# Altium schematic sheet Sheet1.SchDoc
size A0; Organization: Altium Limited; Address1: L3, 12a Rodborough Rd; Address2: Frenchs Forest; Address3: NSW; Address4: Australia 2086
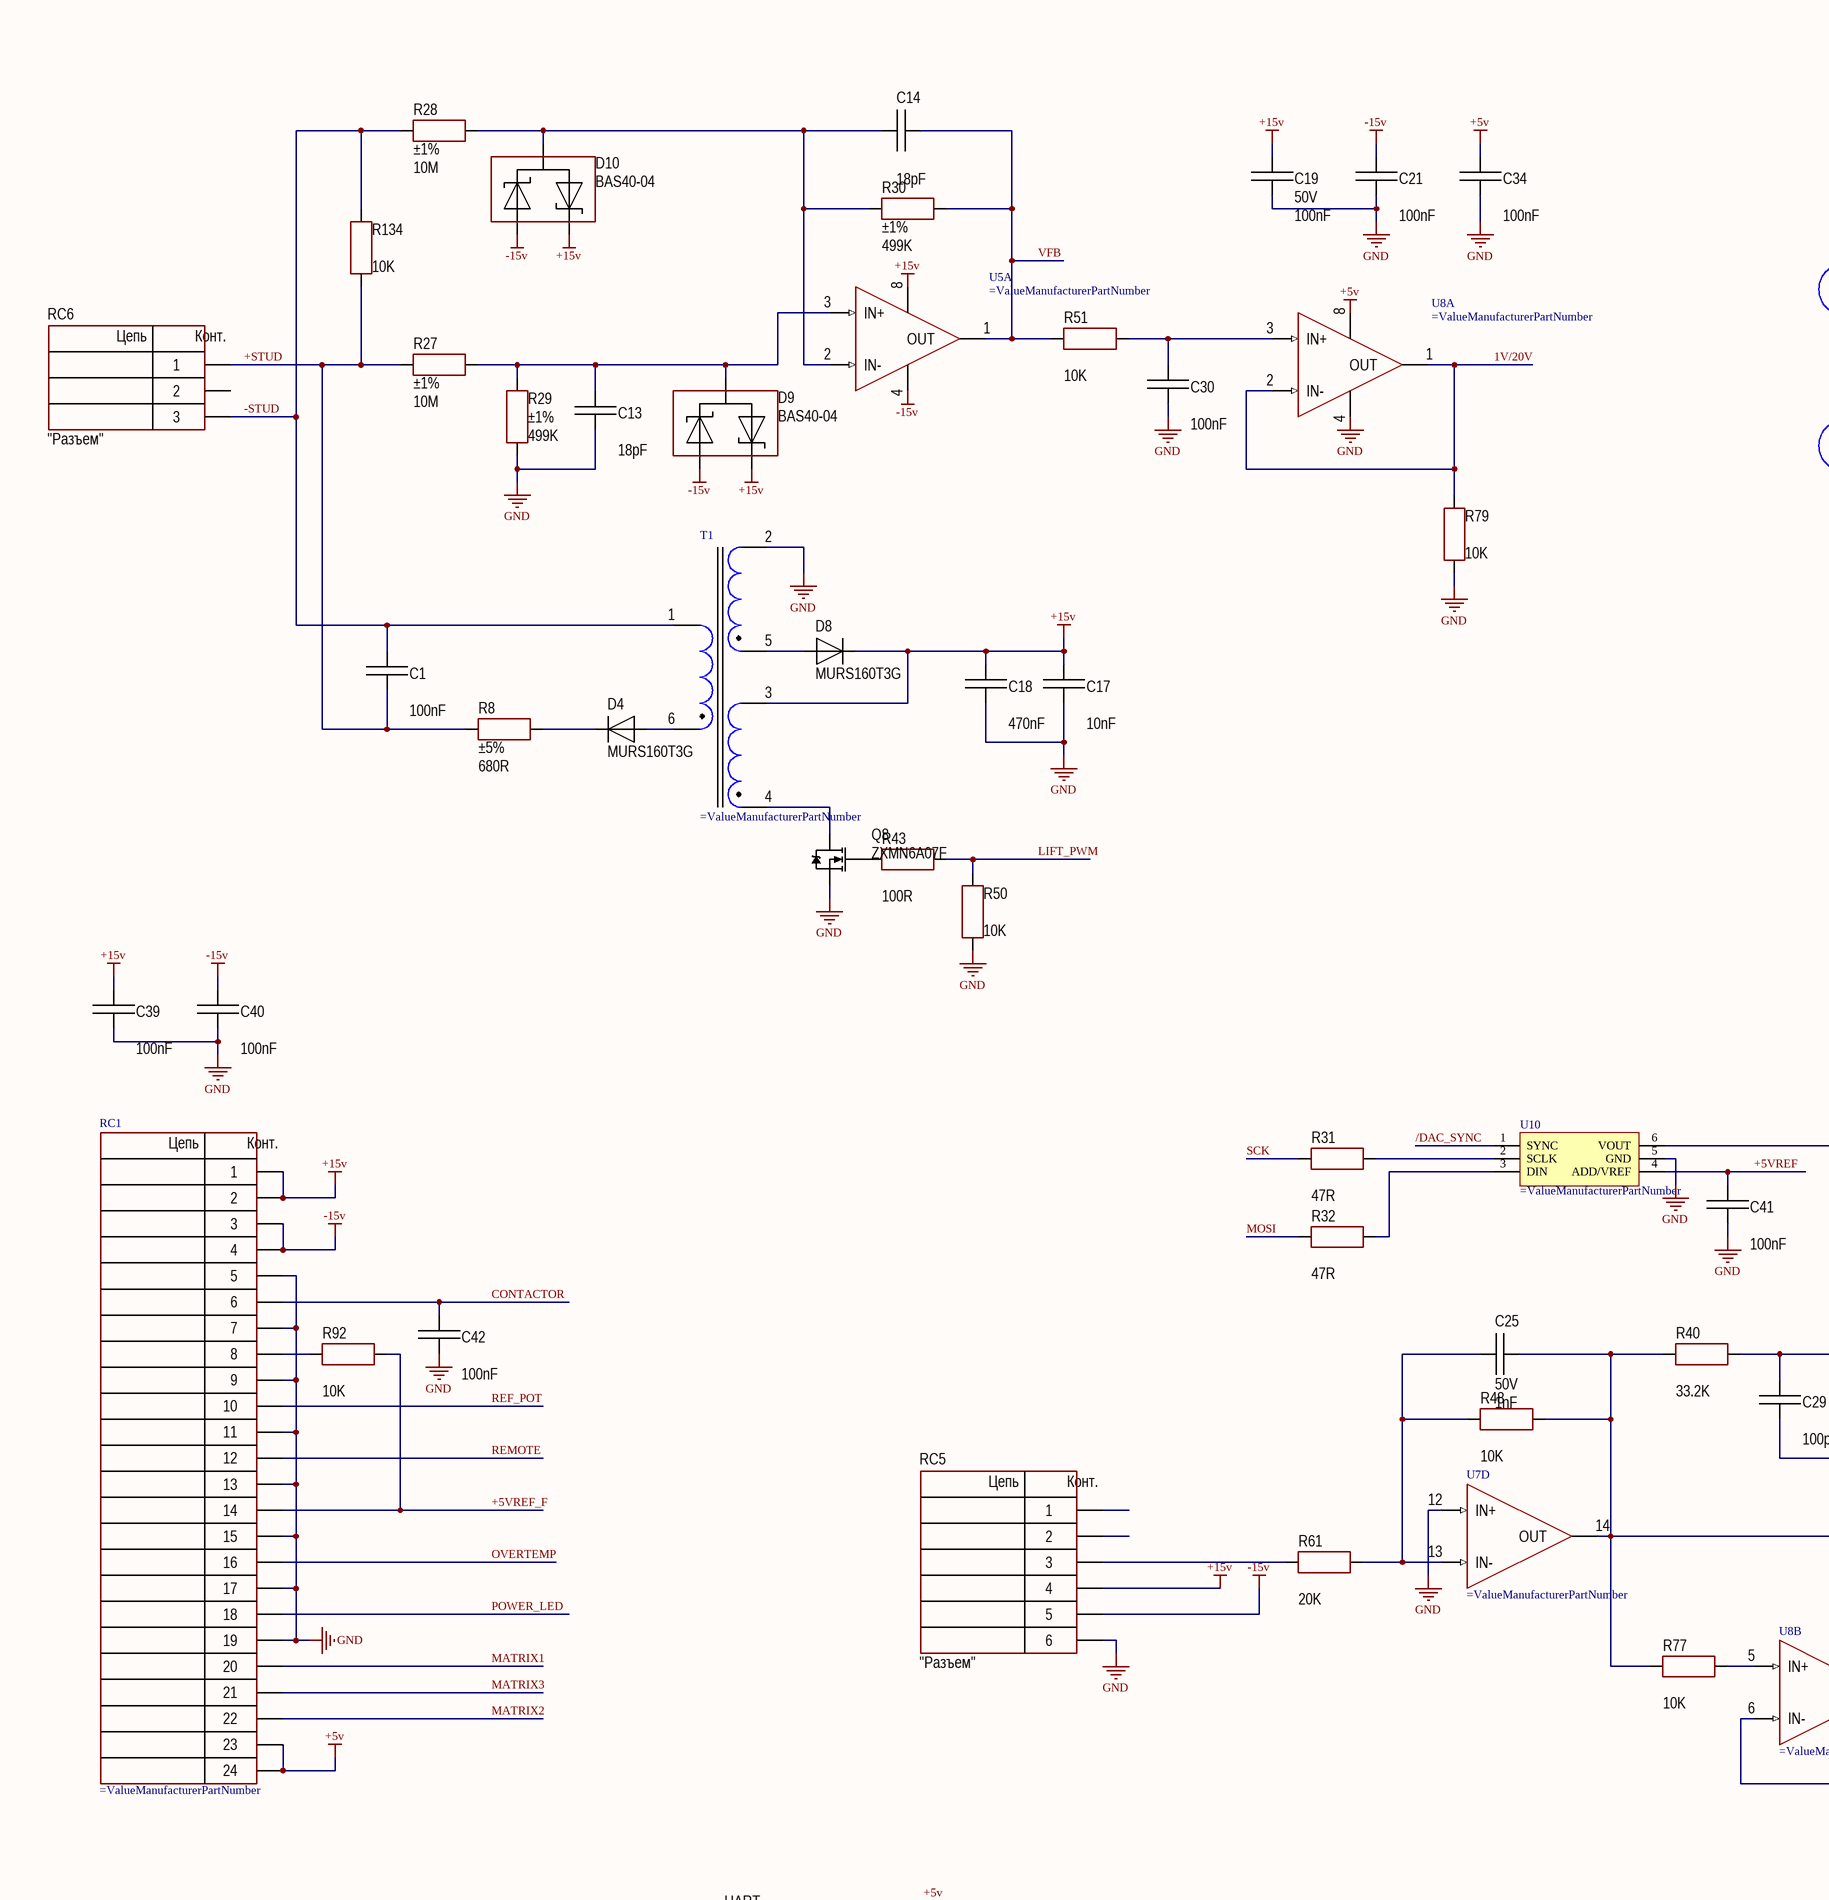
[diagram p0: Sheet1.SchDoc, top left]
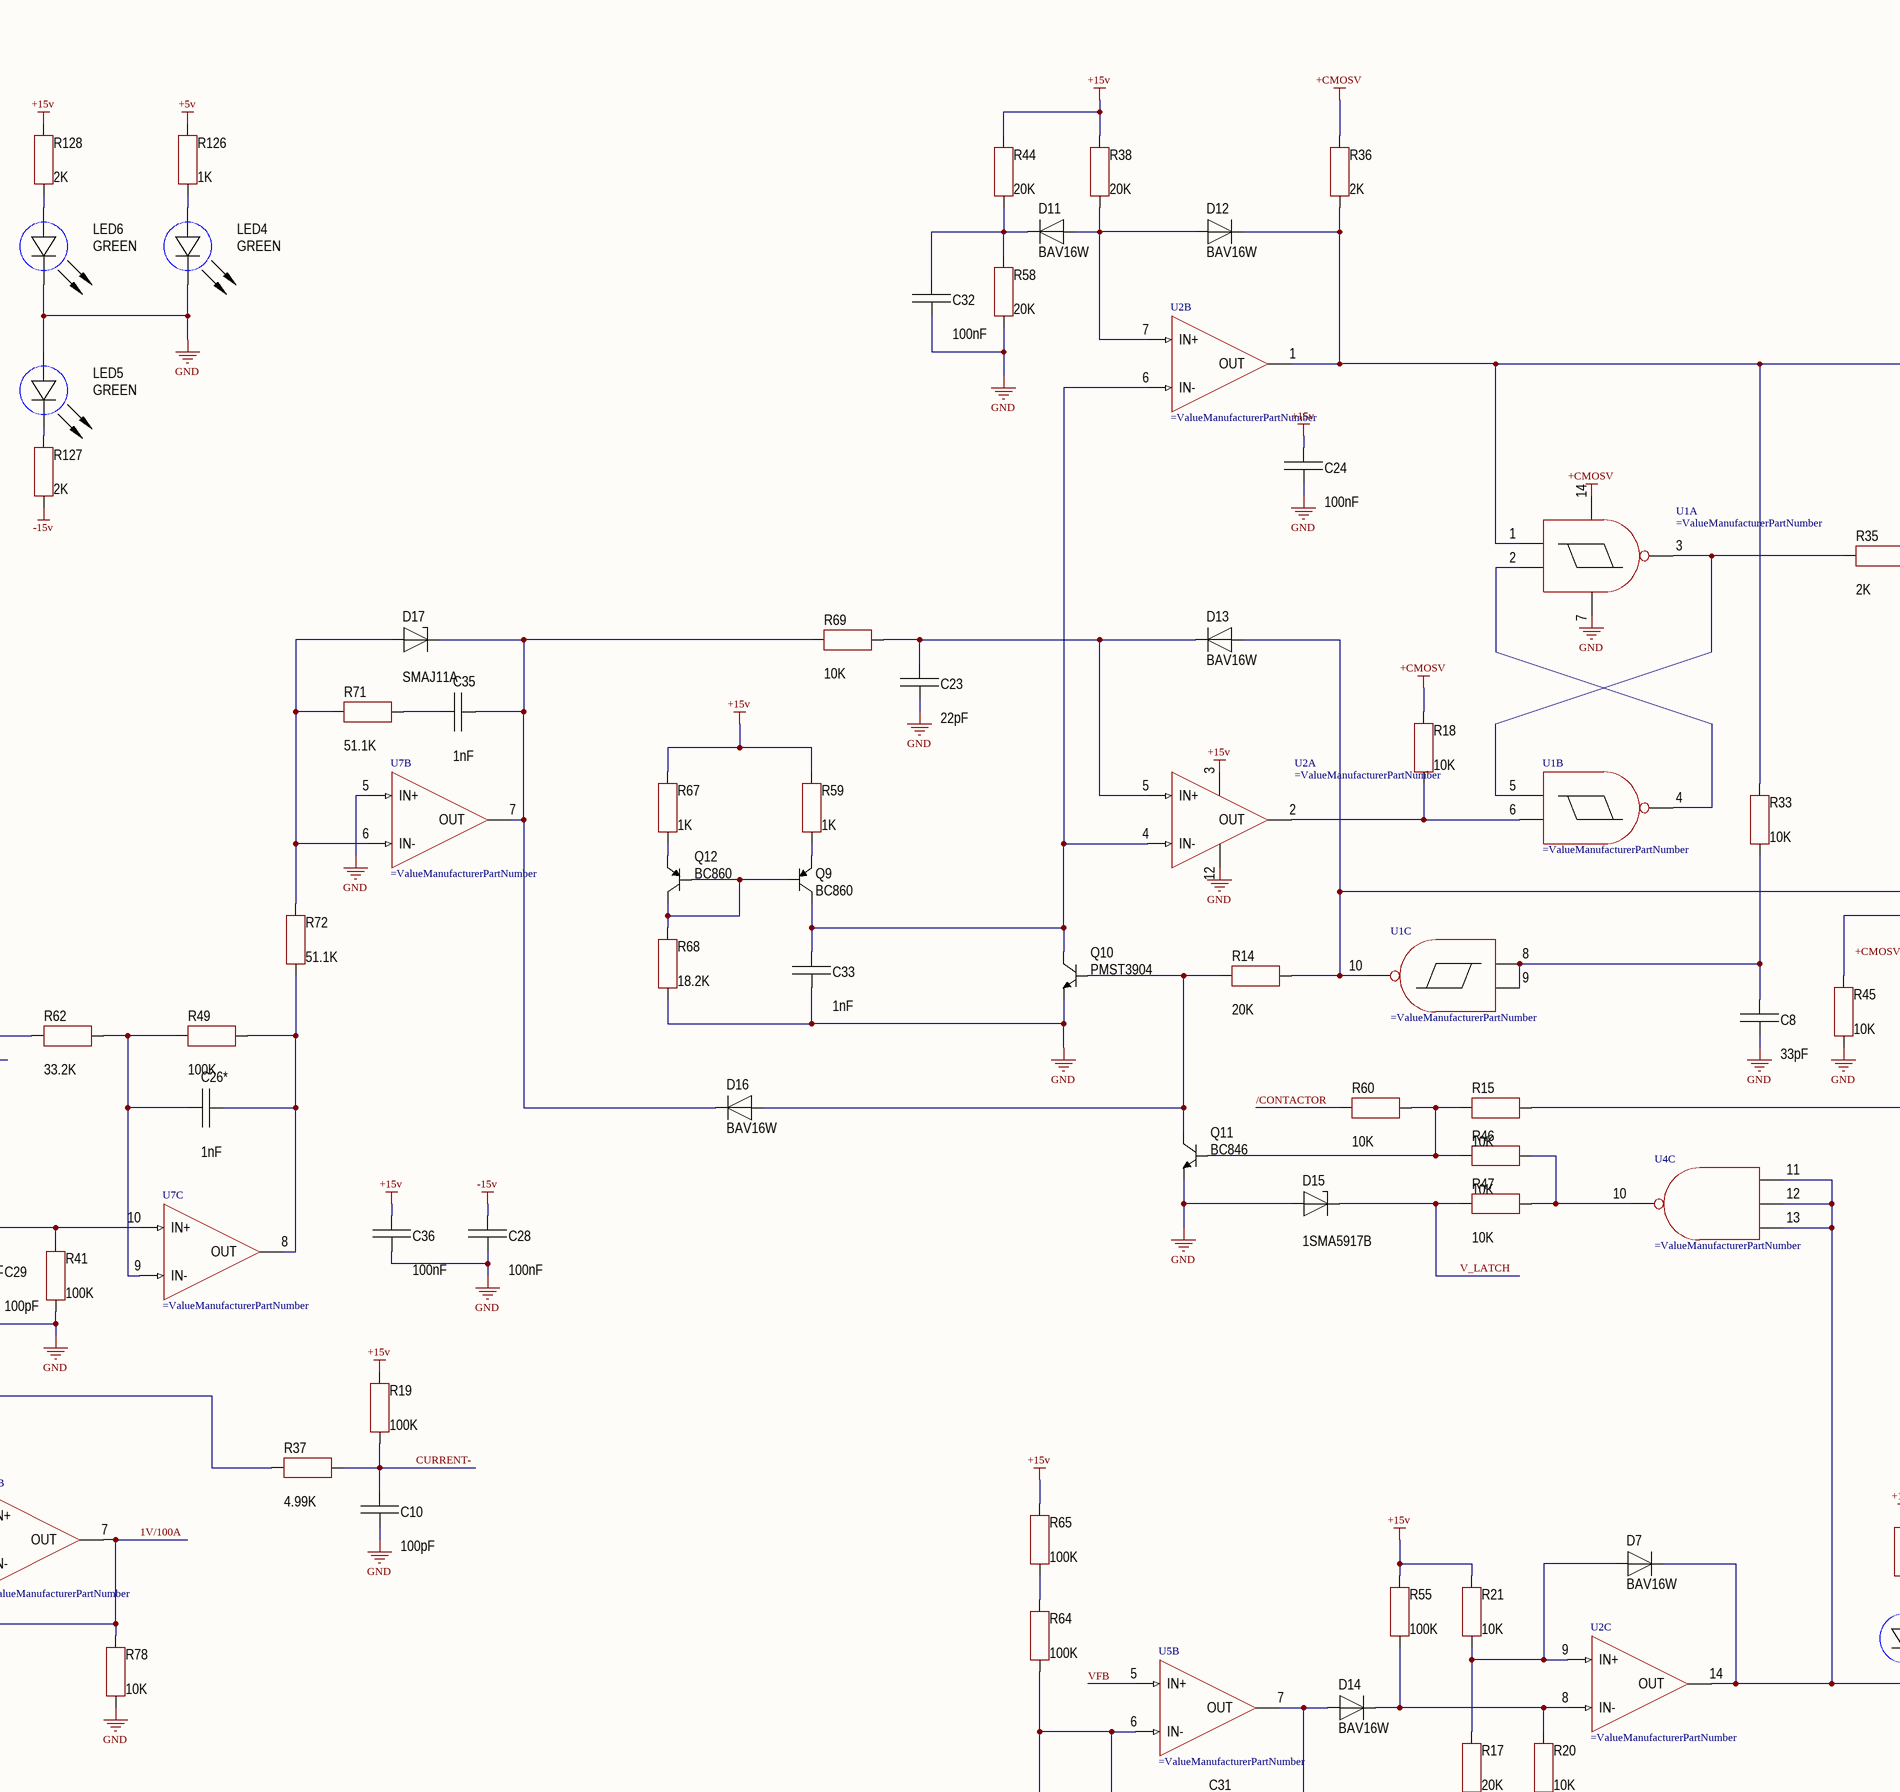
[diagram p1: Sheet1.SchDoc, top middle]
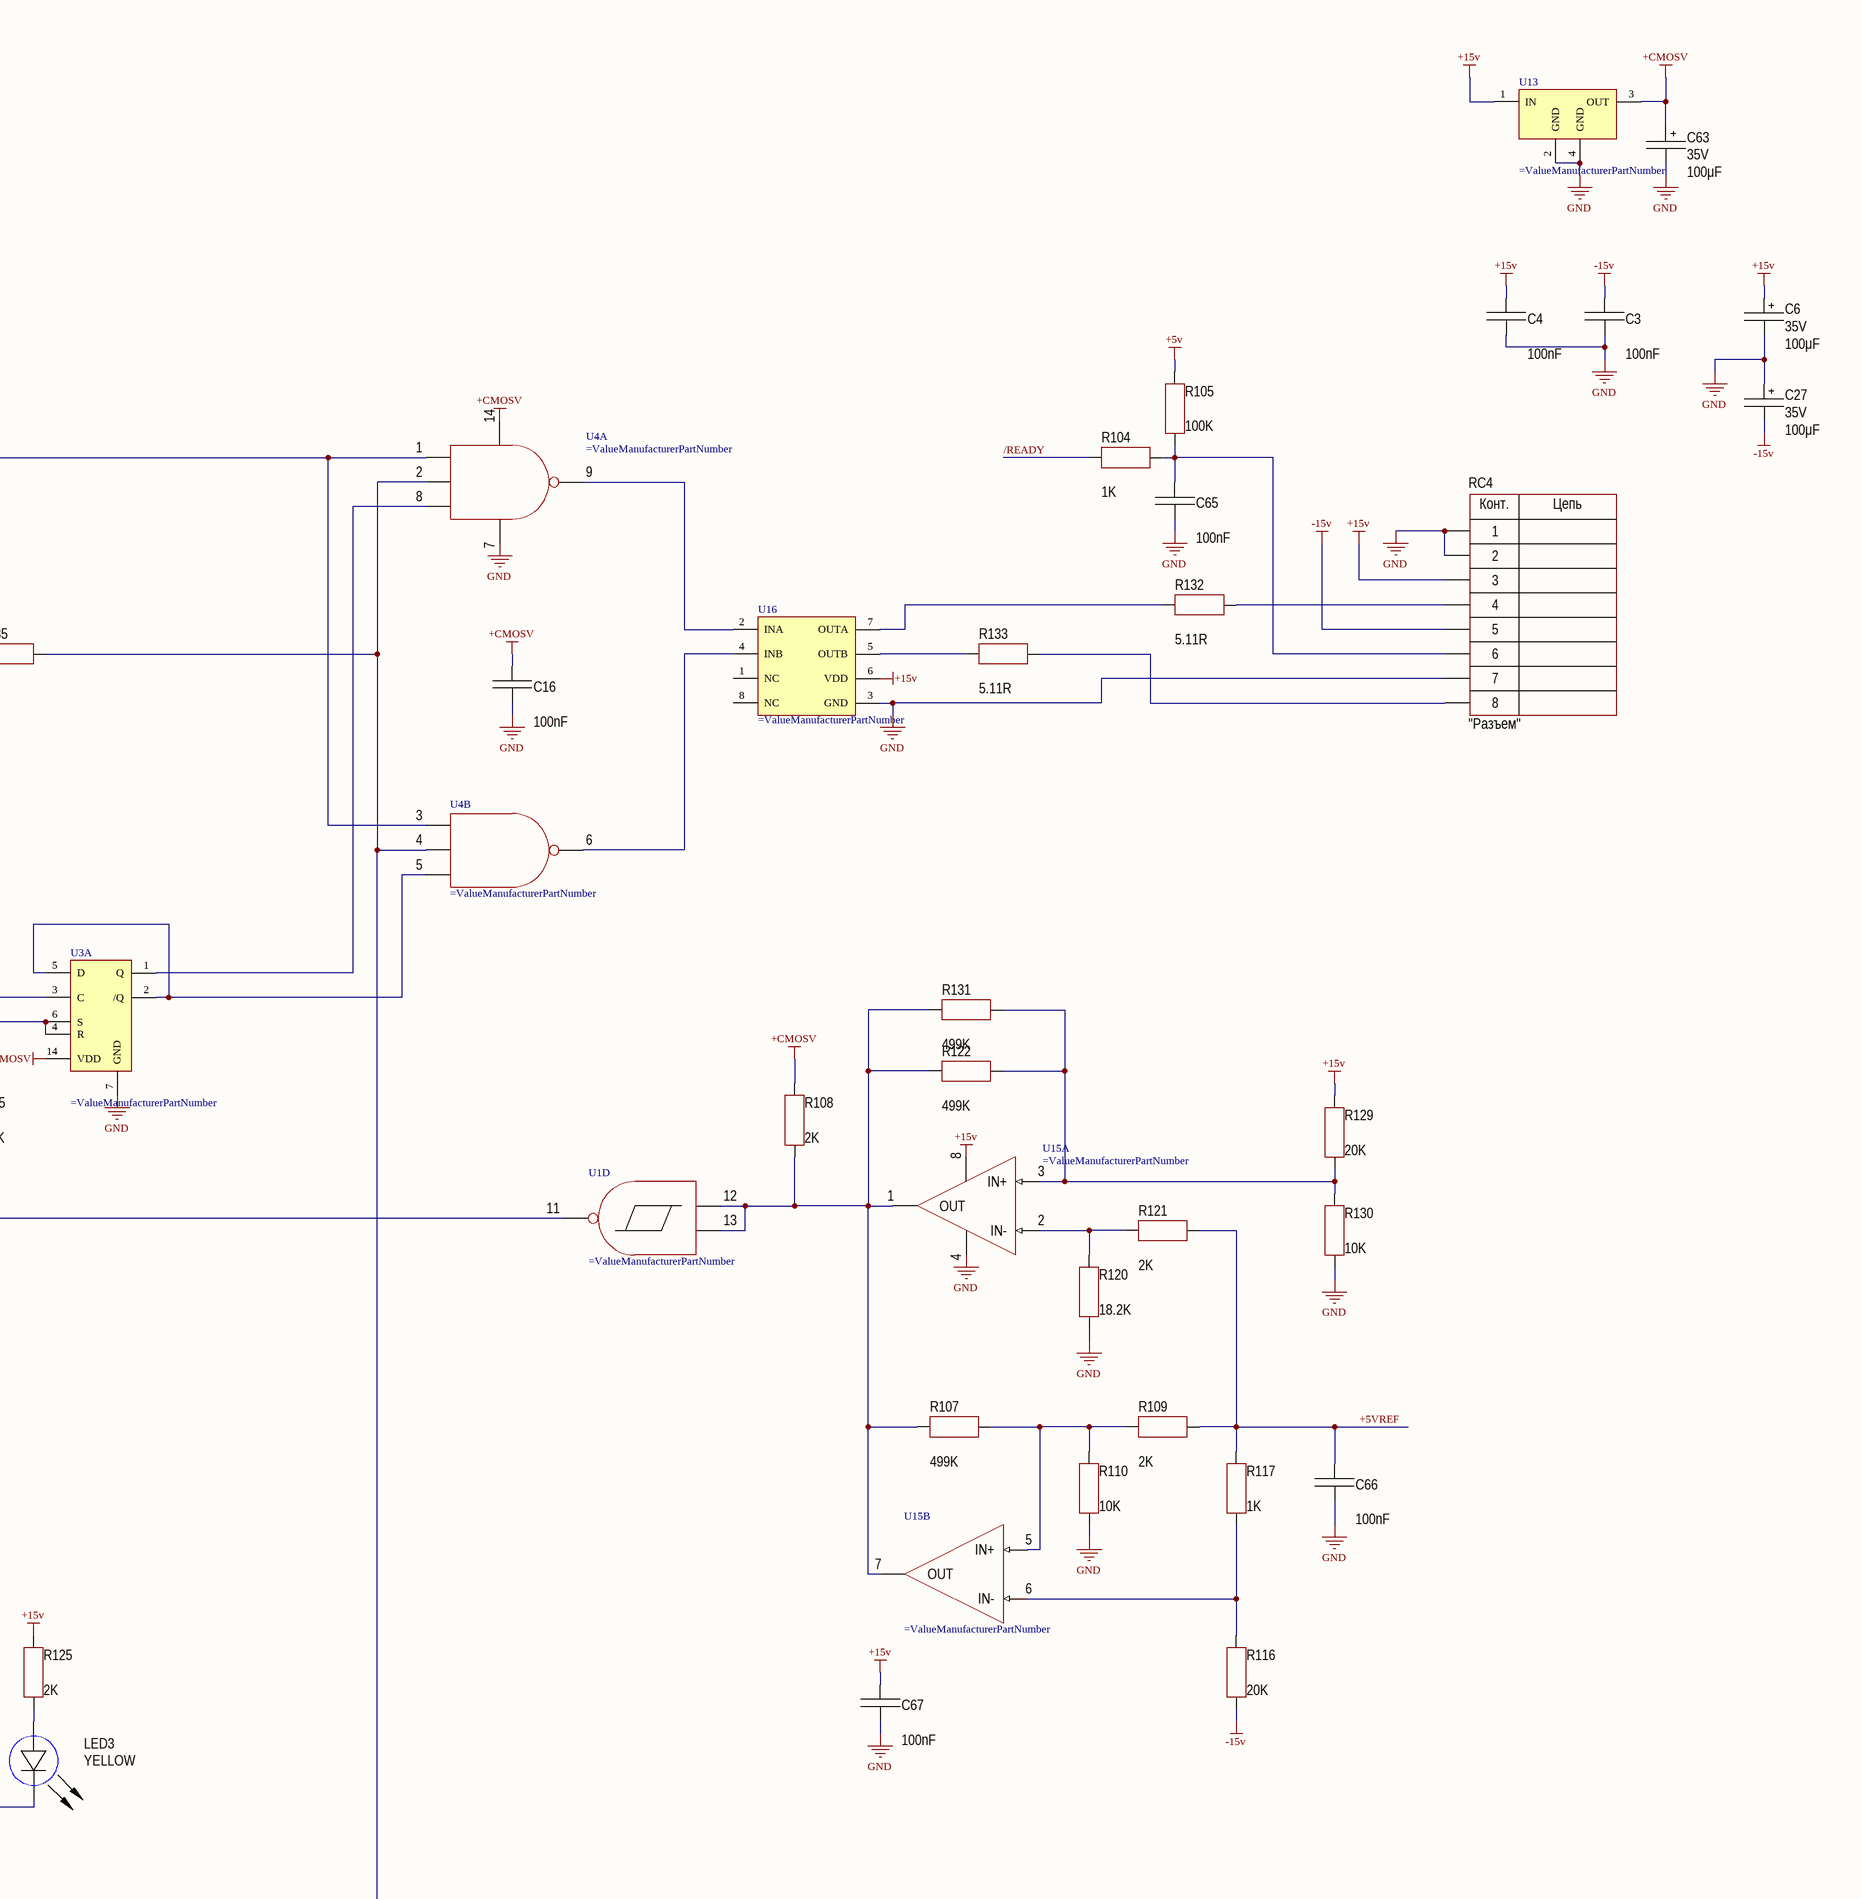
[diagram p2: Sheet1.SchDoc, top right]
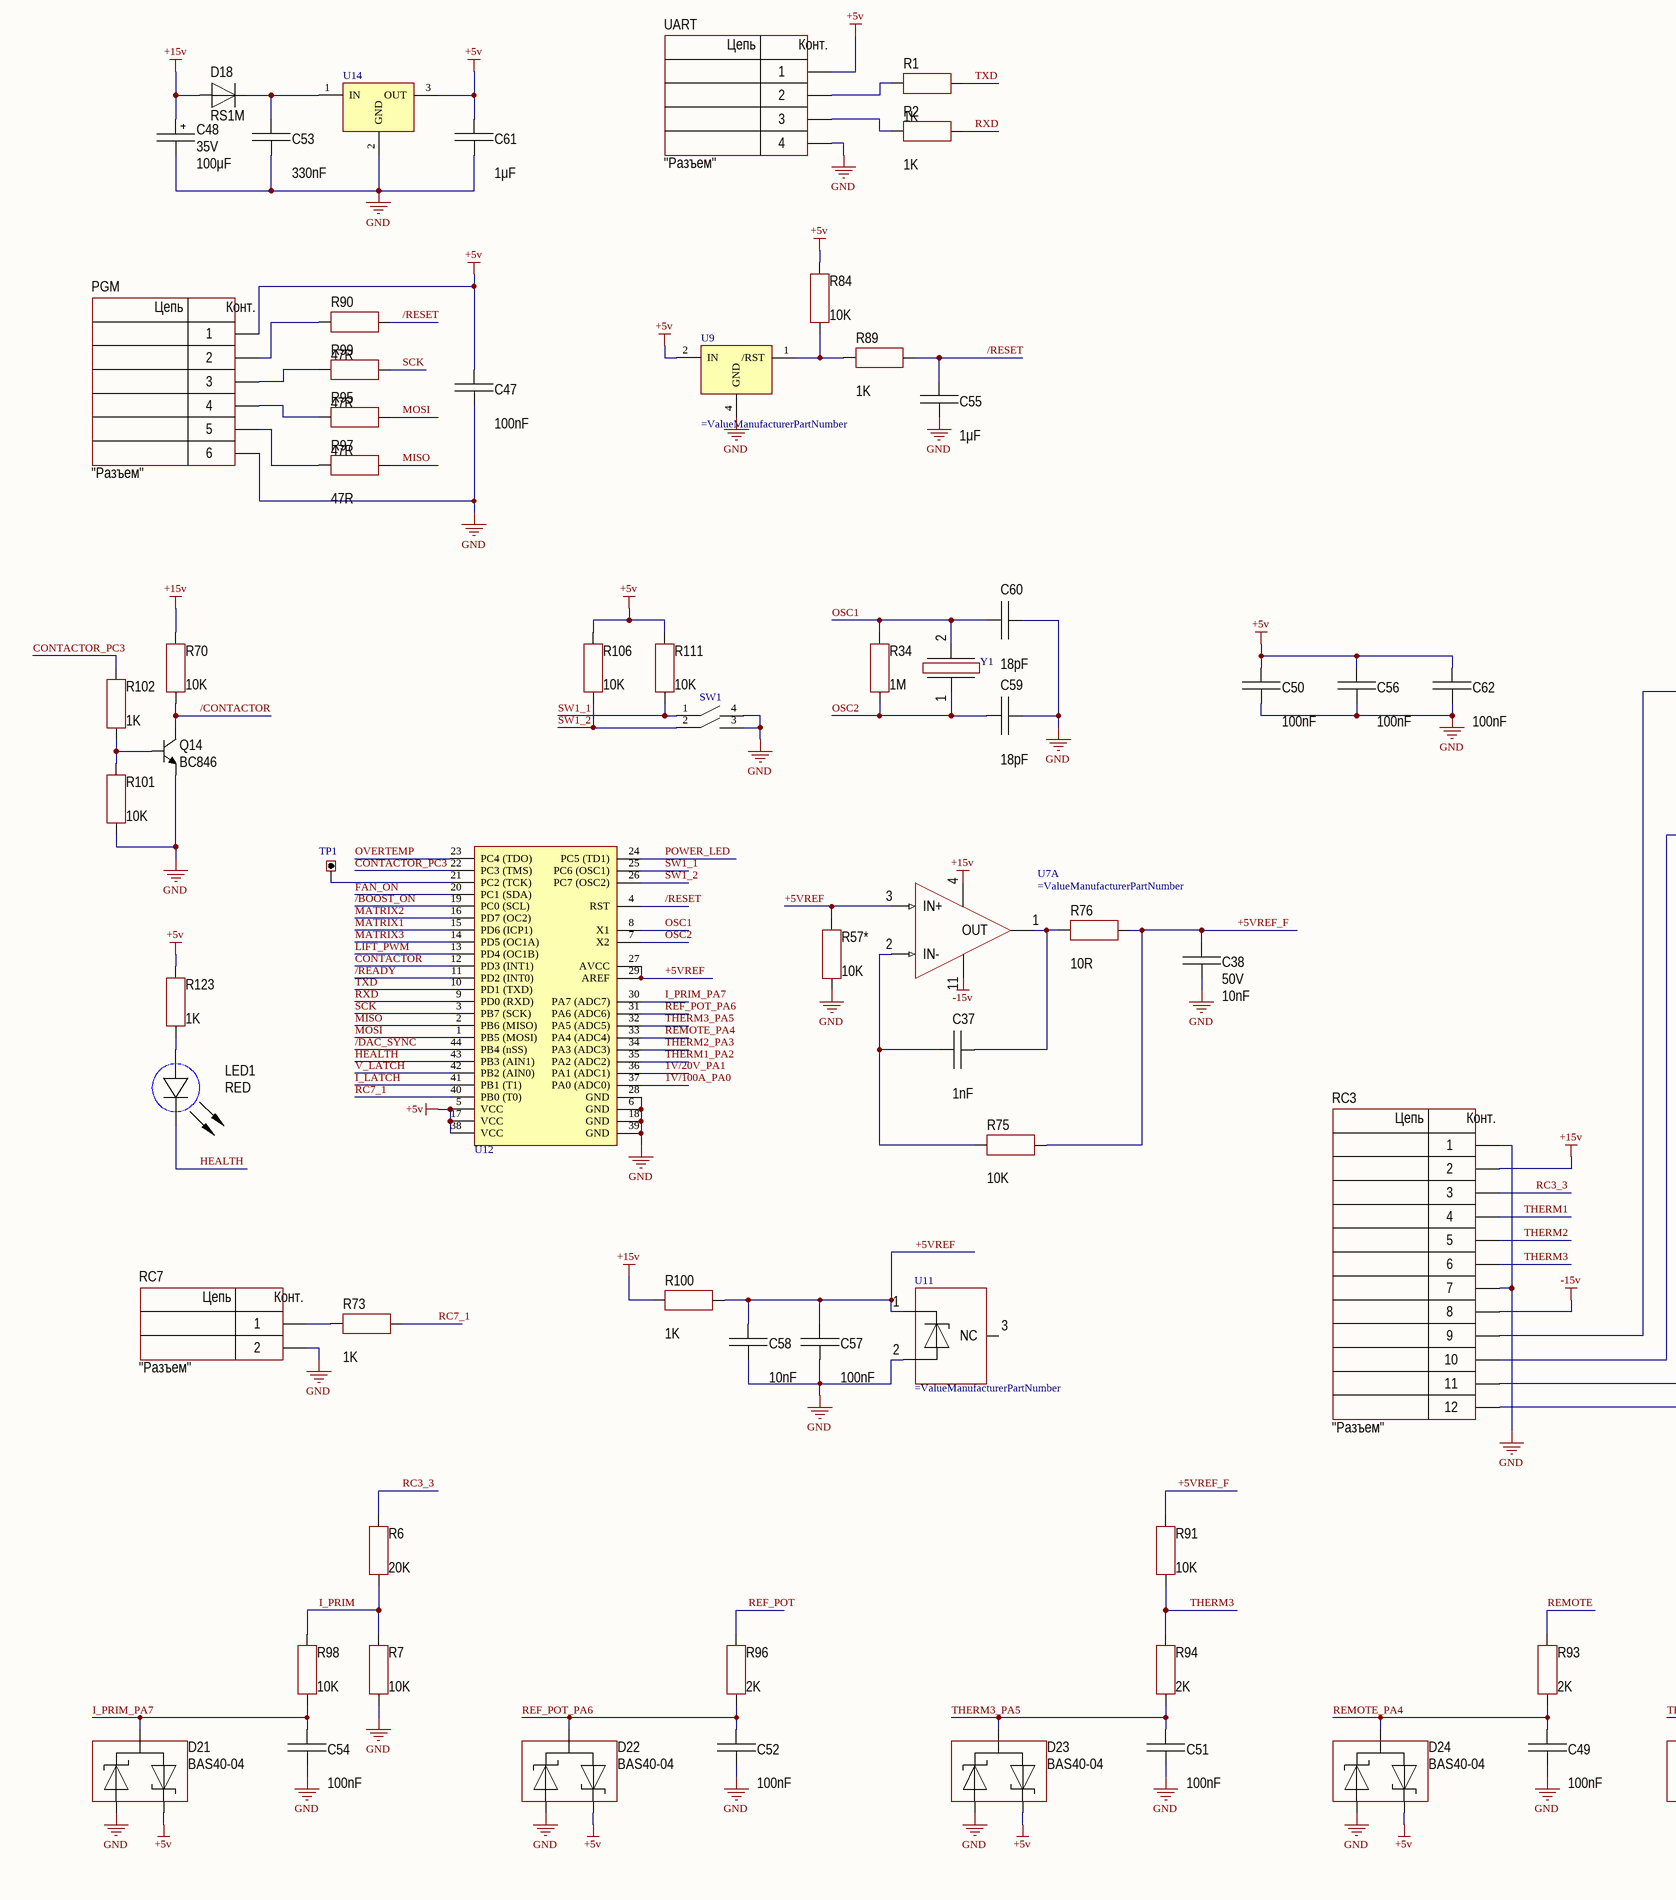
[diagram p3: Sheet1.SchDoc, bottom left]
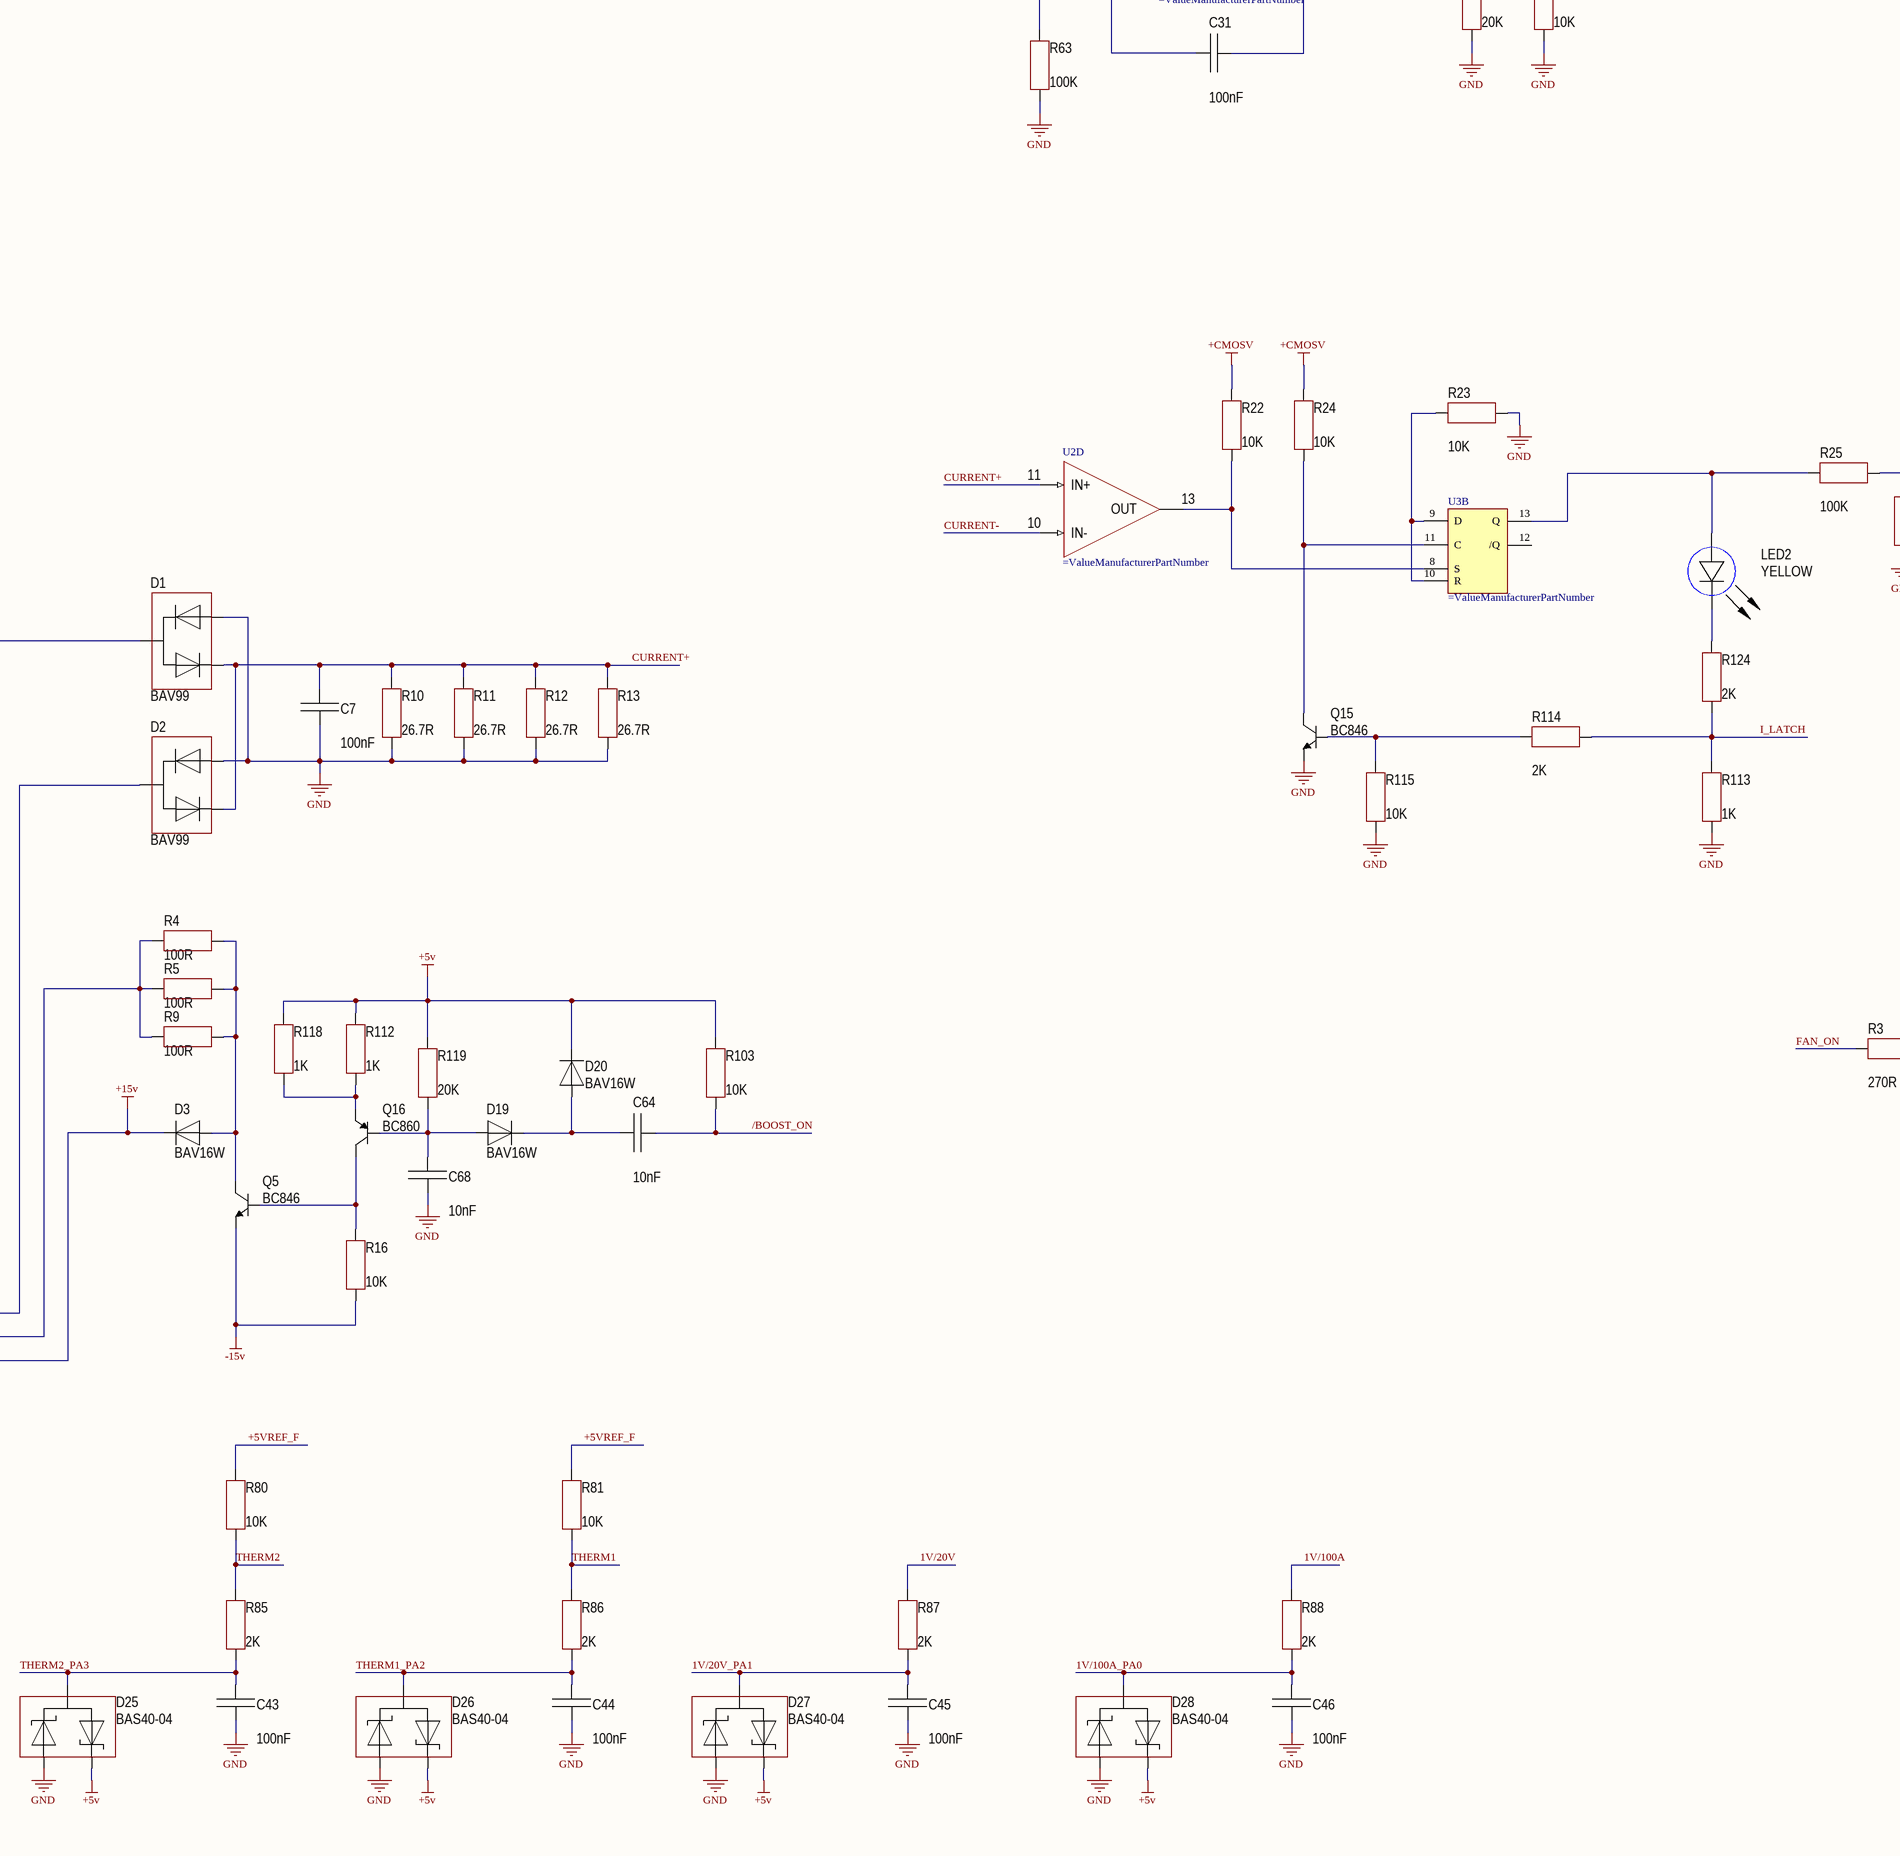
[diagram p4: Sheet1.SchDoc, bottom middle]
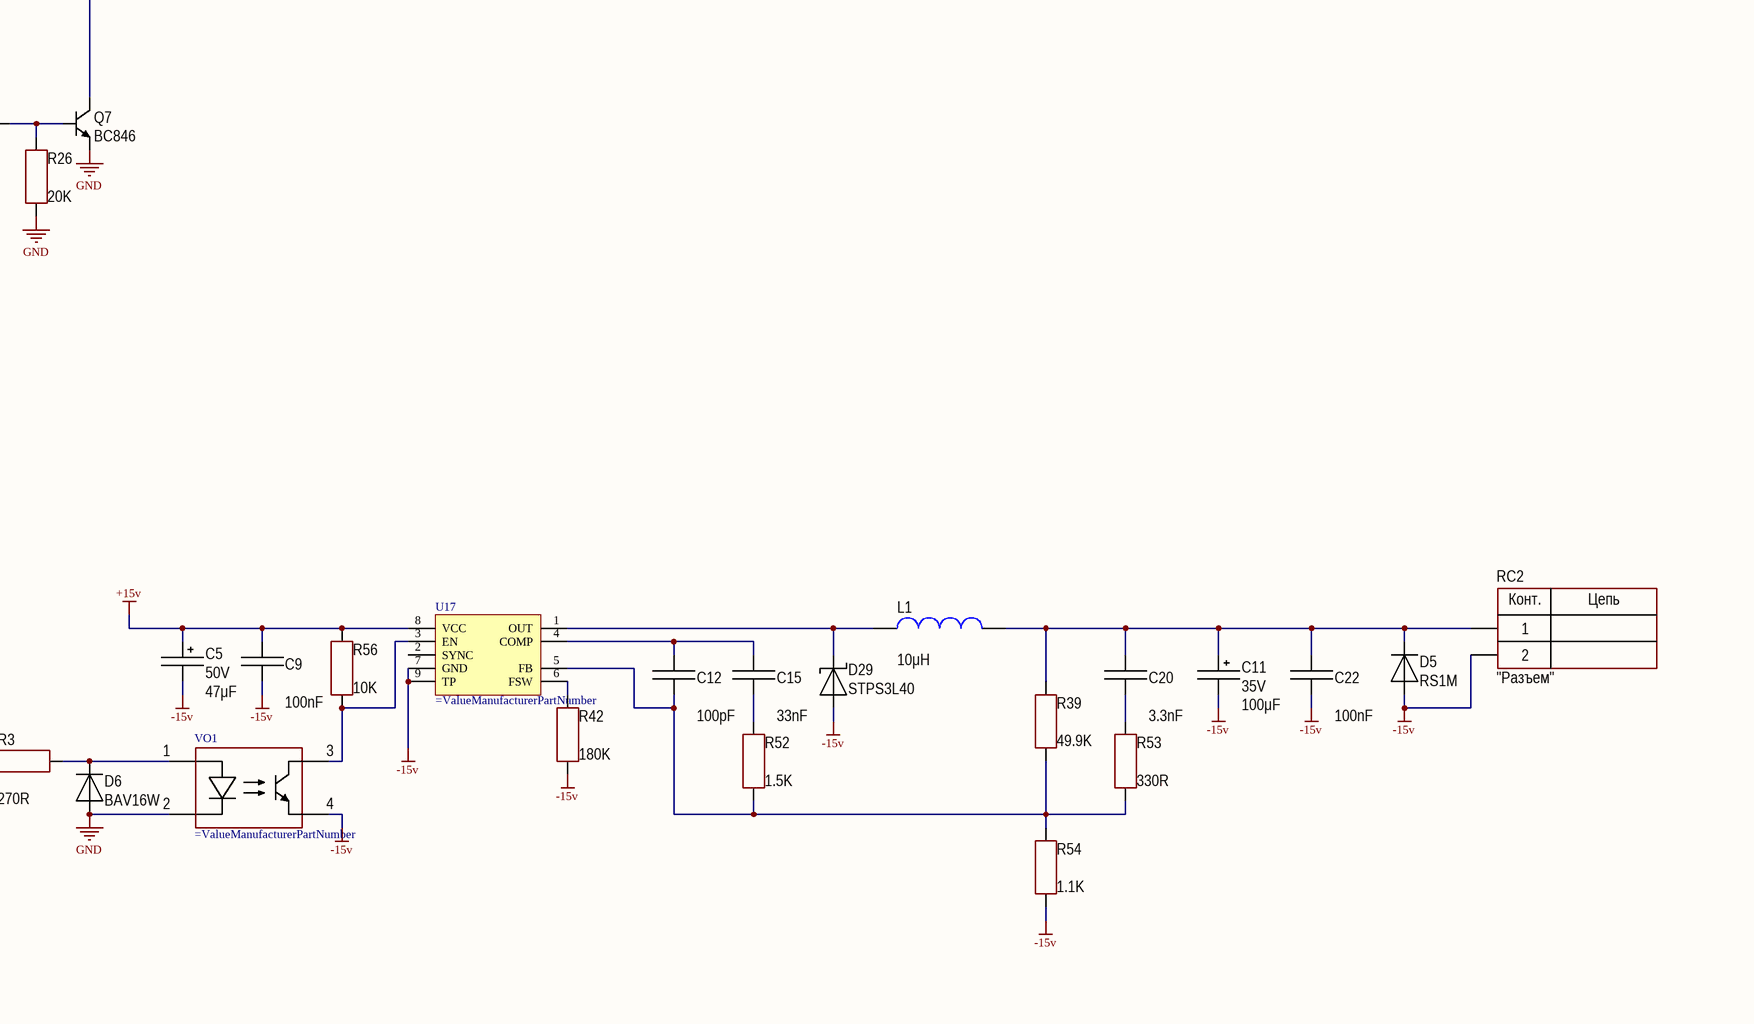
[diagram p5: Sheet1.SchDoc, bottom right]

## Parts
C1  value 100nF  [К10-17Б]
C3  value 100nF  [CAP: 1206]
C4  value 100nF  [CAP: 1206]
C5  value 47μF  Voltage: 50V  [CAPAE7466X80L]
C6  value 100μF  Voltage: 35V  [CAPAE7466X80L]
C7  value 100nF  [CAP: 1206]
C8  value 33pF  [CAP: 1206]
C9  value 100nF  [CAP: 1206]
C10  value 100pF  [CAP: 1206]
C11  value 100μF  Voltage: 35V  [CAPAE7466X80L]
C12  value 100pF  [CAP: 1206]
C13  value 18pF  [CAP: 1206]
C14  value 18pF  [CAP: 1206]
C15  value 33nF  [CAP: 1206]
C16  value 100nF  [CAP: 1206]
C17  value 10nF  [CAP: 1206]
C18  value 470nF  [CAP: 1206]
C19  value 100nF  Voltage: 50V  [CAP: 1206]
C20  value 3.3nF  [CAP: 1206]
C21  value 100nF  [CAP: 1206]
C22  value 100nF  [CAP: 1206]
C23  value 22pF  [CAP: 1206]
C24  value 100nF  [CAP: 1206]
C25  value 1nF  Voltage: 50V  [CAP: 1206]
C26*  value 1nF  [CAP: 1206]
C27  value 100μF  Voltage: 35V  [CAPAE7466X80L]
C28  value 100nF  [CAP: 1206]
C29  value 100pF  [CAP: 1206]
C30  value 100nF  [CAP: 1206]
C31  value 100nF  [CAP: 1206]
C32  value 100nF  [CAP: 1206]
C33  value 1nF  [CAP: 1206]
C34  value 100nF  [CAP: 1206]
C35  value 1nF  [CAP: 1206]
C36  value 100nF  [CAP: 1206]
C37  value 1nF  [CAP: 1206]
C38  value 10nF  Voltage: 50V  [CAP: 1206]
C39  value 100nF  [CAP: 1206]
C40  value 100nF  [CAP: 1206]
C41  value 100nF  [CAP: 1206]
C42  value 100nF  [CAP: 1206]
C43  value 100nF  [CAP: 1206]
C44  value 100nF  [CAP: 1206]
C45  value 100nF  [CAP: 1206]
C46  value 100nF  [CAP: 1206]
C47  value 100nF  [CAP: 1206]
C48  value 100μF  Voltage: 35V  [CAPAE7466X80L]
C49  value 100nF  [CAP: 1206]
C50  value 100nF  [CAP: 1206]
C51  value 100nF  [CAP: 1206]
C52  value 100nF  [CAP: 1206]
C53  value 330nF  [CAP: 1206]
C54  value 100nF  [CAP: 1206]
C55  value 1μF  [CAP: 1206]
C56  value 100nF  [CAP: 1206]
C57  value 100nF  [CAP: 1206]
C58  value 10nF  [CAP: 1206]
C59  value 18pF  [CAP: 1206]
C60  value 18pF  [CAP: 1206]
C61  value 1μF  [CAP: 1206]
C62  value 100nF  [CAP: 1206]
C63  value 100μF  Voltage: 35V  [CAPAE7466X80L]
C64  value 10nF  [CAP: 1206]
C65  value 100nF  [CAP: 1206]
C66  value 100nF  [CAP: 1206]
C67  value 100nF  [CAP: 1206]
C68  value 10nF  [CAP: 1206]
D1  PartNumber: BAV99  [SOT23]
D2  PartNumber: BAV99  [SOT23]
D3  PartNumber: BAV16W  [DIODE: SOD123]
D4  PartNumber: MURS160T3G  [DIODE: SMB]
D5  PartNumber: RS1M  [DIODE: SMA]
D6  PartNumber: BAV16W  [DIODE: SOD123]
D7  PartNumber: BAV16W  [DIODE: SOD123]
D8  PartNumber: MURS160T3G  [DIODE: SMB]
D9  PartNumber: BAS40-04  [SOT23]
D10  PartNumber: BAS40-04  [SOT23]
D11  PartNumber: BAV16W  [DIODE: SOD123]
D12  PartNumber: BAV16W  [DIODE: SOD123]
D13  PartNumber: BAV16W  [DIODE: SOD123]
D14  PartNumber: BAV16W  [DIODE: SOD123]
D15  PartNumber: 1SMA5917B  [DIODE: SMA]
D16  PartNumber: BAV16W  [DIODE: SOD123]
D17  PartNumber: SMAJ11A  [DIODE: SMA]
D18  PartNumber: RS1M  [DIODE: SMA]
D19  PartNumber: BAV16W  [DIODE: SOD123]
D20  PartNumber: BAV16W  [DIODE: SOD123]
D21  PartNumber: BAS40-04  [SOT23]
D22  PartNumber: BAS40-04  [SOT23]
D23  PartNumber: BAS40-04  [SOT23]
D24  PartNumber: BAS40-04  [SOT23]
D25  PartNumber: BAS40-04  [SOT23]
D26  PartNumber: BAS40-04  [SOT23]
D27  PartNumber: BAS40-04  [SOT23]
D28  PartNumber: BAS40-04  [SOT23]
D29  PartNumber: STPS3L40  [DIODE: SMC]
L1  value 10μH  [MSS1038T]
LED1  Color: RED  [LED: 1206G]
LED2  Color: YELLOW  [LED: 1206G]
LED3  Color: YELLOW  [LED: 1206G]
LED4  Color: GREEN  [LED: 1206G]
LED5  Color: GREEN  [LED: 1206R]
LED6  Color: GREEN  [LED: 1206G]
PGM  CommentText: "Разъем"  [CON: PLS-6]
Q5  PartNumber: BC846  [SOT23]
Q7  PartNumber: BC846  [SOT23]
Q8  PartNumber: ZXMN6A07F  [SOT23]
Q9  PartNumber: BC860  [SOT23]
Q10  PartNumber: PMST3904  [SOT23]
Q11  PartNumber: BC846  [SOT23]
Q12  PartNumber: BC860  [SOT23]
Q14  PartNumber: BC846  [SOT23]
Q15  PartNumber: BC846  [SOT23]
Q16  PartNumber: BC860  [SOT23]
R1  value 1K  [RES: 1206]
R2  value 1K  [RES: 1206]
R3  value 270R  [RES: 1206]
R4  value 100R  [RES: 1206]
R5  value 100R  [RES: 1206]
R6  value 20K  [RES: 1206]
R7  value 10K  [RES: 1206]
R8  value 680R  Tolerance: ±5%  [RES: 1206]
R9  value 100R  [RES: 1206]
R10  value 26.7R  [RES: 1206]
R11  value 26.7R  [RES: 1206]
R12  value 26.7R  [RES: 1206]
R13  value 26.7R  [RES: 1206]
R14  value 20K  [RES: 1206]
R15  value 10K  [RES: 1206]
R16  value 10K  [RES: 1206]
R17  value 20K  [RES: 1206]
R18  value 10K  [RES: 1206]
R19  value 100K  [RES: 1206]
R20  value 10K  [RES: 1206]
R21  value 10K  [RES: 1206]
R22  value 10K  [RES: 1206]
R23  value 10K  [RES: 1206]
R24  value 10K  [RES: 1206]
R25  value 100K  [RES: 1206]
R26  value 20K  [RES: 1206]
R27  value 10M  Tolerance: ±1%  [CFR-50]
R28  value 10M  Tolerance: ±1%  [CFR-50]
R29  value 499K  Tolerance: ±1%  [RES: 1206]
R30  value 499K  Tolerance: ±1%  [RES: 1206]
R31  value 47R  [RES: 1206]
R32  value 47R  [RES: 1206]
R33  value 10K  [RES: 1206]
R34  value 1M  [RES: 1206]
R35  value 2K  [RES: 1206]
R36  value 2K  [RES: 1206]
R37  value 4.99K  [RES: 1206]
R38  value 20K  [RES: 1206]
R39  value 49.9K  [RES: 1206]
R40  value 33.2K  [RES: 1206]
R41  value 100K  [RES: 1206]
R42  value 180K  [RES: 1206]
R43  value 100R  [RES: 1206]
R44  value 20K  [RES: 1206]
R45  value 10K  [RES: 1206]
R46  value 10K  [RES: 1206]
R47  value 10K  [RES: 1206]
R48  value 10K  [RES: 1206]
R49  value 100K  [RES: 1206]
R50  value 10K  [RES: 1206]
R51  value 10K  [RES: 1206]
R52  value 1.5K  [RES: 1206]
R53  value 330R  [RES: 1206]
R54  value 1.1K  [RES: 1206]
R55  value 100K  [RES: 1206]
R56  value 10K  [RES: 1206]
R57*  value 10K  [RES: 1206]
R58  value 20K  [RES: 1206]
R59  value 1K  [RES: 1206]
R60  value 10K  [RES: 1206]
R61  value 20K  [RES: 1206]
R62  value 33.2K  [RES: 1206]
R63  value 100K  [RES: 1206]
R64  value 100K  [RES: 1206]
R65  value 100K  [RES: 1206]
R67  value 1K  [RES: 1206]
R68  value 18.2K  [RES: 1206]
R69  value 10K  [RES: 1206]
R70  value 10K  [RES: 1206]
R71  value 51.1K  [RES: 1206]
R72  value 51.1K  [RES: 1206]
R73  value 1K  [RES: 1206]
R75  value 10K  [RES: 1206]
R76  value 10R  [RES: 1206]
R77  value 10K  [RES: 1206]
R78  value 10K  [RES: 1206]
R79  value 10K  [RES: 1206]
R80  value 10K  [RES: 1206]
R81  value 10K  [RES: 1206]
R84  value 10K  [RES: 1206]
R85  value 2K  [RES: 1206]
R86  value 2K  [RES: 1206]
R87  value 2K  [RES: 1206]
R88  value 2K  [RES: 1206]
R89  value 1K  [RES: 1206]
R90  value 47R  [RES: 1206]
R91  value 10K  [RES: 1206]
R92  value 10K  [RES: 1206]
R93  value 2K  [RES: 1206]
R94  value 2K  [RES: 1206]
R95  value 47R  [RES: 1206]
R96  value 2K  [RES: 1206]
R97  value 47R  [RES: 1206]
R98  value 10K  [RES: 1206]
R99  value 47R  [RES: 1206]
R100  value 1K  [RES: 1206]
R101  value 10K  [RES: 1206]
R102  value 1K  [RES: 1206]
R103  value 10K  [RES: 1206]
R104  value 1K  [RES: 1206]
R105  value 100K  [RES: 1206]
R106  value 10K  [RES: 1206]
R107  value 499K  [RES: 1206]
R108  value 2K  [RES: 1206]
R109  value 2K  [RES: 1206]
R110  value 10K  [RES: 1206]
R111  value 10K  [RES: 1206]
R112  value 1K  [RES: 1206]
R113  value 1K  [RES: 1206]
R114  value 2K  [RES: 1206]
R115  value 10K  [RES: 1206]
R116  value 20K  [RES: 1206]
R117  value 1K  [RES: 1206]
R118  value 1K  [RES: 1206]
R119  value 20K  [RES: 1206]
R120  value 18.2K  [RES: 1206]
R121  value 2K  [RES: 1206]
R122  value 499K  [RES: 1206]
R123  value 1K  [RES: 1206]
R124  value 2K  [RES: 1206]
R125  value 2K  [RES: 1206]
R126  value 1K  [RES: 1206]
R127  value 2K  [RES: 1206]
R128  value 2K  [RES: 1206]
R129  value 20K  [RES: 1206]
R130  value 10K  [RES: 1206]
R131  value 499K  [RES: 1206]
R132  value 5.11R  [RES: 2512]
R133  value 5.11R  [RES: 2512]
R134  value 10K  [CPF-3]
RC1  (no value)  [SCM-24]
RC2  CommentText: "Разъем"  [MOLEX 2]
RC3  CommentText: "Разъем"  [MOLEX 2x6]
RC4  CommentText: "Разъем"  [MOLEX 2x4]
RC5  CommentText: "Разъем"  [MOLEX 2x3]
RC6  CommentText: "Разъем"  [MOLEX 3]
RC7  CommentText: "Разъем"  [CON: PLS-2]
SW1  (no value)  [DPL-2]
T1  (no value)  [T1]
TP1  (no value)  [Test_Point]  (no BOM)
U1  (no value)  [14-SOIC]  (parts A,B,C,D of 4)
U2  (no value)  [14-SOIC]  (parts A,B,C,D of 4)
U3  (no value)  [14-SOIC]  (parts A,B of 2)
U4  (no value)  [14-SOIC]  (parts A,B,C of 3)
U5  (no value)  [8-SOIC]  (parts A,B of 2)
U7  (no value)  [14-SOIC]  (parts A,B,C,D of 4)
U8  (no value)  [8-SOIC]  (parts A,B of 2)
U9  (no value)  [8-SOIC]
U10  (no value)  [SC70-6]
U11  (no value)  [SOT23]
U12  (no value)  [QFP80P1200X1200X120-44N]
U13  (no value)  [SOT223]
U14  (no value)  [D2PAK]
U15  (no value)  [8-SOIC]  (parts A,B of 2)
U16  (no value)  [8-SOIC]
U17  (no value)  [HSOP8]
UART  CommentText: "Разъем"  [CON: PLS-4]
VO1  (no value)  [SOP254P980X405-4L]
Y1  (no value)  [HC49SM]

## Nets
+5v: C34.2 C47.2 C50.2 C56.2 C61.2 C62.2 D20.2 D21.2 D22.2 D23.2 D24.2 D25.2 D26.2 D27.2 D28.2 PGM.1 R84.2 R103.2 R105.1 R106.2 R111.2 R112.2 R118.2 R119.2 R123.2 R126.2 RC1.23 RC1.24 U8.8(V+) U9.2(IN) U12.5(VCC) U12.17(VCC) U12.38(VCC) U14.3(OUT) UART.1
+15v: C4.2 C5.1 C6.1 C9.1 C17.2 C18.2 C19.2 C24.2 C36.2 C39.2 C48.1 C67.2 D3.2 D8.2 D9.2 D10.2 D18.1 R19.2 R21.2 R38.2 R44.2 R55.2 R56.2 R59.2 R65.2 R67.2 R70.2 R100.2 R125.2 R128.2 R129.2 RC1.1 RC1.2 RC3.2 RC3.12 RC4.3 RC5.4 T1.3 U2.3(V+) U5.8(V+) U7.4(V+) U13.1(IN) U15.8(V+) U16.6(VDD) U17.8(VCC)
+CMOSV: C16.2 C63.1 R18.2 R22.2 R24.2 R36.2 R108.2 U1.14 U3.14(VDD) U4.14 U13.3(OUT)
-15v: C3.2 C5.2 C9.2 C11.2 C21.2 C22.2 C27.2 C28.2 C40.2 D5.1 D9.1 D10.1 D29.1 Q5.2(E) R16.1 R42.1 R54.2 R116.1 R127.1 RC1.3 RC1.4 RC2.2 RC3.8 RC4.5 RC5.5 U5.4(V-) U7.11(V-) U17.7(GND) U17.9(TP) VO1.4(E)
GND: C3.1 C4.1 C6.2 C7.2 C8.1 C10.1 C13.1 C16.1 C17.1 C18.1 C19.1 C21.1 C23.2 C24.1 C27.1 C28.1 C29.1 C30.1 C32.2 C33.2 C34.1 C36.1 C38.2 C39.1 C40.1 C41.1 C42.1 C43.2 C44.2 C45.2 C46.2 C47.1 C48.2 C49.2 C50.1 C51.2 C52.2 C53.1 C54.2 C55.1 C56.1 C57.2 C58.2 C59.1 C60.1 C61.1 C62.1 C63.2 C65.2 C66.2 C67.1 C68.2 D1.1 D2.1 D6.1 D15.1(A) D21.1 D22.1 D23.1 D24.1 D25.1 D26.1 D27.1 D28.1 LED4.2(C) LED5.1(A) LED6.2(C) PGM.6 Q7.2(E) Q8.2(S) Q10.2(E) Q11.2(E) Q14.2(E) Q15.2(E) R7.1 R10.1 R11.1 R12.1 R13.1 R17.1 R20.1 R23.1 R26.2 R29.1 R41.1 R45.1 R50.1 R57*.1 R58.1 R63.1 R68.1 R78.1 R79.1 R101.1 R110.1 R113.1 R115.1 R120.1 R130.1 RC1.5 RC1.7 RC1.9 RC1.11 RC1.13 RC1.15 RC1.17 RC1.19 RC3.1 RC3.7 RC4.1 RC4.2 RC4.7 RC5.6 RC7.2 SW1.3 SW1.4 T1.2 U1.7 U2.12(V-) U3.7(GND) U4.7 U7.5(IN+) U7.12(IN+) U8.4(V-) U9.4(GND) U10.5(GND) U11.2 U12.6(GND) U12.18(GND) U12.28(GND) U12.39(GND) U13.2(GND) U13.4(GND) U14.2(GND) U15.4(V-) U16.3(GND) UART.4 VO1.2(C)
1V/20V: R79.2 R87.2 U8.1(OUT) U8.2(IN-)
1V/20V_PA1: C45.1 D27.3 R87.1 U12.36(PA1_(ADC1))
1V/100A: R78.2 R88.2 U8.6(IN-) U8.7(OUT)
1V/100A_PA0: C46.1 D28.3 R88.1 U12.37(PA0_(ADC0))
+5VREF: C41.2 C57.1 C58.1 C66.1 R57*.2 R100.1 R109.1 R117.2 R121.1 U7.3(IN+) U10.4(ADD/VREF) U11.1 U12.27(AVCC) U12.29(AREF)
+5VREF_F: C38.1 R75.1 R76.1 R80.2 R81.2 R91.2 R92.2 RC1.14
+STUD: C1.1 R8.1 R27.1 R134.1 RC6.1
-STUD: C1.2 R28.2 R134.2 RC6.3 T1.1
/BOOST_ON: C64.2 R103.1 U12.19(PC0_(SCL))
/CONTACTOR: Q14.3(C) R60.2 R70.1
/DAC_SYNC: U10.1(SYNC) U12.44(PB4_(nSS))
/READY: R104.2 U12.11(PD2_(INT0))
/RESET: C55.2 R89.2 R90.2 U12.4(RST)
CONTACTOR: C42.2 RC1.6 U12.12(PD3_(INT1))
CONTACTOR_PC3: R102.2 U12.22(PC3_(TMS))
CURRENT+: C7.1 D1.2 D2.2 R10.2 R11.2 R12.2 R13.2 U2.11(IN+)
CURRENT-: C10.2 R19.1 R37.2 U2.10(IN-)
FAN_ON: R3.2 U12.20(PC1_(SDA))
HEALTH: LED1.2(C) U12.43(PB3_(AIN1))
I_LATCH: R113.2 R114.1 R124.1 U12.41(PB1_(T1))
I_PRIM: R6.1 R7.2 R98.2
I_PRIM_PA7: C54.1 D21.3 R98.1 U12.30(PA7_(ADC7))
LIFT_PWM: R43.2 R50.2 U12.13(PD4_(OC1B))
MATRIX1: RC1.20 U12.15(PD6_(ICP1))
MATRIX2: RC1.22 U12.16(PD7_(OC2))
MATRIX3: RC1.21 U12.14(PD5_(OC1A))
MISO: R97.2 U12.2(PB6_(MISO))
MOSI: R32.1 R95.2 U12.1(PB5_(MOSI))
OSC1: C60.2 R34.2 U12.8(X1) Y1.2
OSC2: C59.2 R34.1 U12.7(X2) Y1.1
OVERTEMP: RC1.16 U12.23(PC4_(TDO))
POWER_LED: RC1.18 U12.24(PC5_(TD1))
RC3_3: R6.2 RC3.3
RC7_1: R73.1 U12.40(PB0_(T0))
REF_POT: R96.2 RC1.10
REF_POT_PA6: C52.1 D22.3 R96.1 U12.31(PA6_(ADC6))
REMOTE: R93.2 RC1.12
REMOTE_PA4: C49.1 D24.3 R93.1 U12.33(PA4_(ADC4))
RXD: R2.2 U12.9(PD0_(RXD))
SCK: R31.1 R99.2 U12.3(PB7_(SCK))
SW1_1: R111.1 SW1.1 U12.25(PC6_(OSC1))
SW1_2: R106.1 SW1.2 U12.26(PC7_(OSC2))
THERM1: R81.1 R86.2 RC3.4
THERM1_PA2: C44.1 D26.3 R86.1 U12.35(PA2_(ADC2))
THERM2: R80.1 R85.2 RC3.5
THERM2_PA3: C43.1 D25.3 R85.1 U12.34(PA3_(ADC3))
THERM3: R91.1 R94.2 RC3.6
THERM3_PA5: C51.1 D23.3 R94.1 U12.32(PA5_(ADC5))
TXD: R1.2 U12.10(PD1_(TXD))
V_LATCH: D15.2(C) R47.2 U12.42(PB2_(AIN0))
VFB: C14.1 R30.2 R51.1 U5.1(OUT) U5.5(IN+)
NetC8_2: C8.2 R33.1 U1.8 U1.9
NetC11_1: C11.1 C20.1 C22.1 D5.2 L1.1 R39.1 RC2.1
NetC12_1: C12.1 C15.1 U17.4(COMP)
NetC12_2: C12.2 R39.2 R52.2 R53.2 R54.1 U17.5(FB)
NetC13_2: C13.2 D9.3 R27.2 R29.2 U5.3(IN+)
NetC14_2: C14.2 D10.3 R28.1 R30.1 U5.2(IN-)
NetC15_2: C15.2 R52.1
NetC20_2: C20.2 R53.1
NetC23_1: C23.1 D13.2 R69.2 U2.5(IN+)
NetC25_1: C25.1 R37.1 R40.1 R48.2 R77.1 U7.14(OUT)
NetC25_2: C25.2 R48.1 R61.2 U7.13(IN-)
NetC26*_1: C26*.1 R49.2 R72.1 U7.8(OUT)
NetC26*_2: C26*.2 R49.1 R62.2 U7.9(IN-)
NetC29_2: C29.2 R40.2 R41.2 U7.10(IN+)
NetC30_2: C30.2 R51.2 U8.3(IN+)
NetC31_1: C31.1 D14.1 U5.7(OUT)
NetC31_2: C31.2 R63.2 R64.1 U5.6(IN-)
NetC32_1: C32.1 D11.2 R44.1 R58.2
NetC33_1: C33.1 Q9.3(C) Q10.3(C) U2.4(IN-) U2.6(IN-)
NetC35_1: C35.1 D16.2 D17.2(C) R69.1 U7.7(OUT)
NetC35_2: C35.2 R71.2
NetC37_1: C37.1 R76.2 U7.1(OUT)
NetC37_2: C37.2 R75.2 U7.2(IN-)
NetC53_2: C53.2 D18.2 U14.1(IN)
NetC64_1: C64.1 D19.2 D20.1
NetC65_1: C65.1 R104.1 R105.2 RC4.6
NetC68_1: C68.1 D19.1 Q16.1(B) R119.1
NetD1_3: D1.3 RC3.9
NetD2_3: D2.3 RC3.10
NetD3_1: D3.1 Q5.3(C) R4.1 R5.1 R9.1
NetD4_1: D4.1 T1.6
NetD4_2: D4.2 R8.2
NetD6_2: D6.2 R3.1 VO1.1(A)
NetD7_1: D7.1 R17.2 R21.1 U2.9(IN+)
NetD7_2: D7.2 LED3.2(C) U2.14(OUT) U4.11 U4.12 U4.13
NetD8_1: D8.1 T1.5
NetD11_1: D11.1 D12.1 R38.1 U2.7(IN+)
NetD12_2: D12.2 R33.2 R36.1 U1.1 U2.1(OUT) U4.1 U4.3
NetD13_1: D13.1 R14.1 U1.10 U3.3(C)
NetD14_2: D14.2 R20.2 R55.1 U2.8(IN-)
NetD16_1: D16.1 Q10.1(B) Q11.3(C) R14.2
NetD17_1: D17.1(A) R71.1 R72.2 U7.6(IN-)
NetD29_2: D29.2 L1.2 U17.1(OUT)
NetLED1_1: LED1.1(A) R123.1
NetLED2_1: LED2.1(A) R25.2 U3.13(Q)
NetLED2_2: LED2.2(C) R124.2
NetLED3_1: LED3.1(A) R125.1
NetLED4_1: LED4.1(A) R126.1
NetLED5_2: LED5.2(C) R127.2
NetLED6_1: LED6.1(A) R128.1
NetPGM_2: PGM.2 R90.1
NetPGM_3: PGM.3 R99.1
NetPGM_4: PGM.4 R95.1
NetPGM_5: PGM.5 R97.1
NetQ5_1: Q5.1(B) Q16.3(C) R16.2
NetQ7_1: Q7.1(B) R25.1 R26.1
NetQ7_3: Q7.3(C) R35.1 U4.2 U4.4
NetQ8_1: Q8.1(G) R43.1
NetQ8_3: Q8.3(D) T1.4
NetQ9_1: Q9.1(B) Q12.1(B) Q12.3(C) R68.2
NetQ9_2: Q9.2(E) R59.1
NetQ11_1: Q11.1(B) R15.2 R46.2 R60.1
NetQ12_2: Q12.2(E) R67.1
NetQ14_1: Q14.1(B) R101.2 R102.1
NetQ15_1: Q15.1(B) R114.2 R115.2
NetQ15_3: Q15.3(C) R24.1 U3.11(C)
NetQ16_2: Q16.2(E) R112.1 R118.1
NetR1_1: R1.1 UART.2
NetR2_1: R2.1 UART.3
NetR4_2: R4.2 R5.2 R9.2 RC3.11
NetR15_1: R15.1 U1.11
NetR18_1: R18.1 U1.6 U2.2(OUT)
NetR22_1: R22.1 U2.13(OUT) U3.8(S)
NetR23_2: R23.2 U3.9(D) U3.10(R)
NetR31_2: R31.2 U10.2(SCLK)
NetR32_2: R32.2 U10.3(DIN)
NetR35_2: R35.2 U1.3 U1.5
NetR42_2: R42.2 U17.6(FSW)
NetR45_2: R45.2 U3.4(R) U3.6(S)
NetR46_1: R46.1 R47.1 U4.10
NetR56_1: R56.1 U17.3(EN) VO1.3(C)
NetR61_1: R61.1 RC5.3
NetR62_1: R62.1 U10.6(VOUT)
NetR64_2: R64.2 R65.1
NetR73_2: R73.2 RC7.1
NetR77_2: R77.2 U8.5(IN+)
NetR84_1: R84.1 R89.1 U9.1(/RST)
NetR92_1: R92.1 RC1.8
NetR107_1: R107.1 R109.2 R110.2 U15.5(IN+)
NetR107_2: R107.2 R108.1 R122.2 R131.2 U1.12 U1.13 U15.1(OUT) U15.7(OUT)
NetR116_2: R116.2 R117.1 U15.6(IN-)
NetR120_2: R120.2 R121.2 U15.2(IN-)
NetR122_1: R122.1 R129.1 R130.2 R131.1 U15.3(IN+)
NetR132_1: R132.1 RC4.4
NetR132_2: R132.2 U16.7(OUTA)
NetR133_1: R133.1 RC4.8
NetR133_2: R133.2 U16.5(OUTB)
NetTP1_1: TP1.1 U12.21(PC2_(TCK))
NetU1_2: U1.2 U1.4
NetU3_1: U3.1(Q) U4.8
NetU3_2: U3.2(/Q) U3.5(D) U4.5
NetU4_6: U4.6 U16.4(INB)
NetU4_9: U4.9 U16.2(INA)

Not connected (* = marked no-connect by the designer): RC5 1 2; RC6 2; U3 12(/Q); U11 3(NC); U16 1(NC) 8(NC); U17 2(SYNC)

## Notes on the sheet
- Title
- Size:
- Date:
- File:
- A0
- Number:
- Time:
- Revision:
- Sheet
- of
- (in symbol PLS-2) Цепь; Конт.
- (in symbol PLS-3) Цепь; Конт.
- (in symbol PLS-4) Цепь; Конт.
- (in symbol PLS-6) Цепь; Конт.
- (in symbol PLS-8) Конт.; Цепь
- (in symbol PLS-12) Цепь; Конт.
- (in symbol SCM-24) Цепь; Конт.

## Library data of the parts
C1 = Ceramic_1206: Manufacturer: Yageo; PartNumber: CC1206KRX7R9BB104; ValueManufacturerPartNumber: Capacitor, 100nF, К10-17Б; TypeCapacitor: Capacitor; Tolerance: ±10%; TypeDielectric: X7R; Voltage: 500V; Package: К10-17Б; HelpURL: https://www.digikey.com/product-detail/en/yageo/CC1206KRX7R9BB104/311-1179-1-ND/303089; Temperature: -55...+125°C
C3 C4 C7 C9 C16 C21 C22 C24 C28 C30-C32 C34 C36 C39-C47 C49-C52 C54 C56 C57 C62 C65-C67 = Ceramic_1206: Manufacturer: Yageo; PartNumber: CC1206KRX7R9BB104; ValueManufacturerPartNumber: Ceramic capacitor, 100nF, 1206; TypeCapacitor: Ceramic capacitor; Tolerance: ±10%; TypeDielectric: X7R; Voltage: 50V; Package: 1206; HelpURL: https://www.digikey.com/product-detail/en/yageo/CC1206KRX7R9BB104/311-1179-1-ND/303089; Temperature: -55...+125°C
C5 = Aluminium: Manufacturer: Wurth; PartNumber: EEEFK1H470XP; ValueManufacturerPartNumber: EEEFK1H470XP, 47μF, 50V, D8; TypeCapacitor: Aluminium capacitor; Tolerance: ±20%; Impedance: 54mOhm; Package: D8; HelpURL: https://www.digikey.com/product-detail/en/wurth-electronics-inc/860080475013/732-9029-1-ND/5728972; Temperature: -55...+105°C
C6 C11 C27 C48 C63 = Aluminium: Manufacturer: Wurth; PartNumber: EEEFK1V101XP; ValueManufacturerPartNumber: EEEFK1V101XP, 100μF, 35V, D8; TypeCapacitor: Aluminium capacitor; Tolerance: ±20%; Impedance: 54mOhm; Package: D8; HelpURL: https://www.digikey.com/product-detail/en/wurth-electronics-inc/860080475013/732-9029-1-ND/5728972; Temperature: -55...+105°C
C8 = Ceramic_1206: Manufacturer: Yageo; PartNumber: CC1206KRX7R9BB104; ValueManufacturerPartNumber: Ceramic capacitor, 33pF, 1206; TypeCapacitor: Ceramic capacitor; Tolerance: ±10%; TypeDielectric: X7R; Voltage: 50V; Package: 1206; HelpURL: https://www.digikey.com/product-detail/en/yageo/CC1206KRX7R9BB104/311-1179-1-ND/303089; Temperature: -55...+125°C
C10 C12 C29 = Ceramic_1206: Manufacturer: Yageo; PartNumber: CC1206KRX7R9BB104; ValueManufacturerPartNumber: Ceramic capacitor, 100pF, 1206; TypeCapacitor: Ceramic capacitor; Tolerance: ±10%; TypeDielectric: X7R; Voltage: 50V; Package: 1206; HelpURL: https://www.digikey.com/product-detail/en/yageo/CC1206KRX7R9BB104/311-1179-1-ND/303089; Temperature: -55...+125°C
C13 C14 C59 C60 = Ceramic_1206: Manufacturer: Yageo; PartNumber: CC1206KRX7R9BB104; ValueManufacturerPartNumber: Ceramic capacitor, 18pF, 1206; TypeCapacitor: Ceramic capacitor; Tolerance: ±10%; TypeDielectric: X7R; Voltage: 50V; Package: 1206; HelpURL: https://www.digikey.com/product-detail/en/yageo/CC1206KRX7R9BB104/311-1179-1-ND/303089; Temperature: -55...+125°C
C15 = Ceramic_1206: Manufacturer: Yageo; PartNumber: CC1206KRX7R9BB104; ValueManufacturerPartNumber: Ceramic capacitor, 33nF, 1206; TypeCapacitor: Ceramic capacitor; Tolerance: ±10%; TypeDielectric: X7R; Voltage: 50V; Package: 1206; HelpURL: https://www.digikey.com/product-detail/en/yageo/CC1206KRX7R9BB104/311-1179-1-ND/303089; Temperature: -55...+125°C
C17 C58 C64 C68 = Ceramic_1206: Manufacturer: Yageo; PartNumber: CC1206KRX7R9BB104; ValueManufacturerPartNumber: Ceramic capacitor, 10nF, 1206; TypeCapacitor: Ceramic capacitor; Tolerance: ±10%; TypeDielectric: X7R; Voltage: 50V; Package: 1206; HelpURL: https://www.digikey.com/product-detail/en/yageo/CC1206KRX7R9BB104/311-1179-1-ND/303089; Temperature: -55...+125°C
C18 = Ceramic_1206: Manufacturer: Yageo; PartNumber: CC1206KRX7R9BB104; ValueManufacturerPartNumber: Ceramic capacitor, 470nF, 1206; TypeCapacitor: Ceramic capacitor; Tolerance: ±10%; TypeDielectric: X7R; Voltage: 50V; Package: 1206; HelpURL: https://www.digikey.com/product-detail/en/yageo/CC1206KRX7R9BB104/311-1179-1-ND/303089; Temperature: -55...+125°C
C19 = Ceramic_1206: Manufacturer: Yageo; PartNumber: CC1206KRX7R9BB104; ValueManufacturerPartNumber: Ceramic capacitor, 100nF, 1206; TypeCapacitor: Ceramic capacitor; Tolerance: ±10%; TypeDielectric: X7R; Package: 1206; HelpURL: https://www.digikey.com/product-detail/en/yageo/CC1206KRX7R9BB104/311-1179-1-ND/303089; Temperature: -55...+125°C
C20 = Ceramic_1206: Manufacturer: Yageo; PartNumber: CC1206KRX7R9BB104; ValueManufacturerPartNumber: Ceramic capacitor, 3.3nF, 1206; TypeCapacitor: Ceramic capacitor; Tolerance: ±10%; TypeDielectric: X7R; Voltage: 50V; Package: 1206; HelpURL: https://www.digikey.com/product-detail/en/yageo/CC1206KRX7R9BB104/311-1179-1-ND/303089; Temperature: -55...+125°C
C23 = Ceramic_1206: Manufacturer: Yageo; PartNumber: CC1206KRX7R9BB104; ValueManufacturerPartNumber: Ceramic capacitor, 22pF, 1206; TypeCapacitor: Ceramic capacitor; Tolerance: ±10%; TypeDielectric: X7R; Voltage: 50V; Package: 1206; HelpURL: https://www.digikey.com/product-detail/en/yageo/CC1206KRX7R9BB104/311-1179-1-ND/303089; Temperature: -55...+125°C
C25 = Ceramic_1206: Manufacturer: Yageo; PartNumber: CC1206KRX7R9BB104; ValueManufacturerPartNumber: Ceramic capacitor, 1nF, 1206; TypeCapacitor: Ceramic capacitor; Tolerance: ±10%; TypeDielectric: X7R; Package: 1206; HelpURL: https://www.digikey.com/product-detail/en/yageo/CC1206KRX7R9BB104/311-1179-1-ND/303089; Temperature: -55...+125°C
C26* C33 C35 C37 = Ceramic_1206: Manufacturer: Yageo; PartNumber: CC1206KRX7R9BB104; ValueManufacturerPartNumber: Ceramic capacitor, 1nF, 1206; TypeCapacitor: Ceramic capacitor; Tolerance: ±10%; TypeDielectric: X7R; Voltage: 50V; Package: 1206; HelpURL: https://www.digikey.com/product-detail/en/yageo/CC1206KRX7R9BB104/311-1179-1-ND/303089; Temperature: -55...+125°C
C38 = Ceramic_1206: Manufacturer: Yageo; PartNumber: CC1206KRX7R9BB104; ValueManufacturerPartNumber: Ceramic capacitor, 10nF, 1206; TypeCapacitor: Ceramic capacitor; Tolerance: ±10%; TypeDielectric: X7R; Package: 1206; HelpURL: https://www.digikey.com/product-detail/en/yageo/CC1206KRX7R9BB104/311-1179-1-ND/303089; Temperature: -55...+125°C
C53 = Ceramic_1206: Manufacturer: Yageo; PartNumber: CC1206KRX7R9BB104; ValueManufacturerPartNumber: Ceramic capacitor, 330nF, 1206; TypeCapacitor: Ceramic capacitor; Tolerance: ±10%; TypeDielectric: X7R; Voltage: 50V; Package: 1206; HelpURL: https://www.digikey.com/product-detail/en/yageo/CC1206KRX7R9BB104/311-1179-1-ND/303089; Temperature: -55...+125°C
C55 C61 = Ceramic_1206: Manufacturer: Yageo; PartNumber: CC1206KRX7R9BB104; ValueManufacturerPartNumber: Ceramic capacitor, 1μF, 1206; TypeCapacitor: Ceramic capacitor; Tolerance: ±10%; TypeDielectric: X7R; Voltage: 50V; Package: 1206; HelpURL: https://www.digikey.com/product-detail/en/yageo/CC1206KRX7R9BB104/311-1179-1-ND/303089; Temperature: -55...+125°C
D1 D2 = Diode_array: Manufacturer: Diodes Incorporated; ValueManufacturerPartNumber: BAV99, SOT-23; TypeDiode: Diode array; Voltage: 85V; Current: 140mA; VoltageDrop: 1.1V; RecoveryTime: 3us; Package: SOT-23; HelpURL: https://www.digikey.com/product-detail/en/diodes-incorporated/BAV199-7-F/BAV199-FDICT-ND/1033647; Temperature: -65...+150°C
D3 D6 D7 D11-D14 D16 D19 D20 = Diode_single: Manufacturer: DIODES; ValueManufacturerPartNumber: BAV16W@ DIODES, SOD123; TypeDiode: Single diode; Voltage: 1000V; Current: 1A; VoltageDrop: 1V; RecoveryTime: 4ns; Package: SOD123; HelpURL: https://www.digikey.com/product-detail/en/micro-commercial-co/1N4148WX-TP/1N4148WXTPMSCT-ND/717312; Temperature: -55...+150°C
D4 D8 = Diode_single: Manufacturer: Micro Commercial; ValueManufacturerPartNumber: MURS160T3G, SMB; TypeDiode: Single diode; Voltage: 600V; Current: 1A; VoltageDrop: 1V; RecoveryTime: 4ns; Package: SMB; HelpURL: https://www.digikey.com/product-detail/en/micro-commercial-co/1N4148WX-TP/1N4148WXTPMSCT-ND/717312; Temperature: -65...+175°C
D5 D18 = Diode_single: Manufacturer: DIODES; ValueManufacturerPartNumber: RS1M, SMA; TypeDiode: Single diode; Voltage: 1000V; Current: 1A; VoltageDrop: 1V; RecoveryTime: 4ns; Package: SMA; HelpURL: https://www.digikey.com/product-detail/en/micro-commercial-co/1N4148WX-TP/1N4148WXTPMSCT-ND/717312; Temperature: -55...+150°C
D9 D10 D21-D28 = Schottky_array: Manufacturer: Diodes Incorporated; ValueManufacturerPartNumber: BAS40-04, SOT23-3; TypeDiode: Schottky array; Voltage: 40V; Current: 120mA; VoltageDrop: 1V; RecoveryTime: 15pF; Package: SOT23-3; HelpURL: https://www.digikey.com/product-detail/en/diodes-incorporated/MBR0580S1-7/MBR0580S1-7DICT-ND/5080371; Temperature: -55...+150°C
D15 = Zener_single: Manufacturer: Diodes Incorporated; ValueManufacturerPartNumber: 1SMA5917B, SMA; TypeDiode: Zener diode; Current: 500mW; VoltageDrop: 0.9V; RecoveryTime: 17Ohm; Voltage: 5.1V; Package: SMA; HelpURL: https://www.digikey.com/product-detail/en/diodes-incorporated/MMSZ5231B-7-F/MMSZ5231B-FDICT-ND/755506; Temperature: -55...+150°C
D17 = Zener_single: Manufacturer: Diodes Incorporated; ValueManufacturerPartNumber: SMAJ11A, SMA; TypeDiode: Zener diode; Current: 500mW; VoltageDrop: 0.9V; RecoveryTime: 17Ohm; Voltage: 11V; Package: SMA; HelpURL: https://www.digikey.com/product-detail/en/diodes-incorporated/MMSZ5231B-7-F/MMSZ5231B-FDICT-ND/755506; Temperature: -55...+150°C
D29 = Schottky_single: Manufacturer: Diodes Incorporated; ValueManufacturerPartNumber: STPS3L40, SMC; TypeDiode: Schottky diode; Voltage: 80V; Current: 500mA; VoltageDrop: 1V; RecoveryTime: 15pF; Package: SMC; HelpURL: https://www.digikey.com/product-detail/en/diodes-incorporated/MBR0580S1-7/MBR0580S1-7DICT-ND/5080371; Temperature: -55...+150°C
L1 = Inductor_CD43: Manufacturer: Sumida; ValueManufacturerPartNumber: MSS1038T, 10μH; TypeInductor: Fixed inductor; MaxCurrent: 1.04A; Tolerance: ±20%; PartNumber: MSS1038T; Package: MSS1038; HelpURL: https://www.digikey.com/product-detail/en/sumida-america-components-inc/CD43NP-100MC/308-1855-1-ND/3925624; Temperature: -40...+100°C
LED1 = LED_single: ValueManufacturerPartNumber: LED, RED, 1206; PartNumber: BL-LS1206HC; TypeDiode: LED; Manufacturer: *; Package: 1206; HelpURL: *; Temperature: -55...+150°C; Current: *; VoltageDrop: *; ColorParameter: RED
LED2 LED3 = LED_single: ValueManufacturerPartNumber: LED, YELLOW, 1206; PartNumber: BL-LS1206HC; TypeDiode: LED; Manufacturer: *; Package: 1206; HelpURL: *; Temperature: -55...+150°C; Current: *; VoltageDrop: *; ColorParameter: YELLOW
LED4 LED5 = LED_single: ValueManufacturerPartNumber: LED, GREEN, 1206; TypeDiode: LED; Manufacturer: *; Package: 1206; HelpURL: *; Temperature: -55...+150°C; Current: *; VoltageDrop: *; PartNumber: *; ColorParameter: GREEN
LED6 = LED_single: ValueManufacturerPartNumber: LED, GREEN, 1206; PartNumber: BL-LS1206HC; TypeDiode: LED; Manufacturer: *; Package: 1206; HelpURL: *; Temperature: -55...+150°C; Current: *; VoltageDrop: *; ColorParameter: GREEN
PGM = PLS-6: Manufacturer: Connfly; ValueManufacturerPartNumber: PLS-6, 6pin; TypeConnector: Connector; VoltageMax: 500VAC; Pitch: 2.54mm; CurrentMax: 3A; Multichannel: 6pin; HelpURL: https://www.chipdip.ru/product/pls-6; PartNumber: PLS-6
Q5 Q7 Q11 Q14 Q15 = BJT_NPN_132: Manufacturer: ON Semiconductor; ValueManufacturerPartNumber: BC846, SOT-23; TypeTransistor: NPN transistor; VoltageCE: 45V; CurrentCE: 100mA; VoltageSaturation: 0.6V; Frequency: 100MHz; CurrentGain: 420; MaxPower: 300mW; Package: SOT-23; HelpURL: https://www.digikey.com/product-detail/en/on-semiconductor/BC847CLT1G/BC847CLT1GOSCT-ND/917836; Temperature: -55...+125°C
Q8 = MOSFET_N_132: Manufacturer: Infineon Technologies; ValueManufacturerPartNumber: ZXMN6A07F, SOT23-3; TypeTransistor: MOSFET N-channel transistor; VoltageDS: 80V; CurrentDS: 7A; RDS: 34mOhm; GateCharge: 9.1nC; InputCapacitor: 756pF; MaxPower: 2.5W; Package: SOT23-3; HelpURL: https://www.digikey.com/product-detail/en/infineon-technologies/BSC340N08NS3GATMA1/BSC340N08NS3GATMA1TR-ND/2080655; Temperature: -55...+150°C
Q9 Q12 Q16 = BJT_PNP_123: Manufacturer: ON Semiconductor; ValueManufacturerPartNumber: BC860, SOT-23; TypeTransistor: PNP transistor; VoltageCE: 45V; CurrentCE: 100mA; VoltageSaturation: 0.65V; Frequency: 100MHz; CurrentGain: 220; MaxPower: 300mW; Package: SOT-23; HelpURL: https://www.digikey.com/product-detail/en/on-semiconductor/BC857BLT3G/BC857BLT3GOSCT-ND/2704963; Temperature: -55...+125°C
Q10 = BJT_NPN_132: Manufacturer: ON Semiconductor; ValueManufacturerPartNumber: PMST3904, SOT-23; TypeTransistor: NPN transistor; VoltageCE: 45V; CurrentCE: 100mA; VoltageSaturation: 0.6V; Frequency: 100MHz; CurrentGain: 420; MaxPower: 300mW; Package: SOT-23; HelpURL: https://www.digikey.com/product-detail/en/on-semiconductor/BC847CLT1G/BC847CLT1GOSCT-ND/917836; Temperature: -55...+125°C
R1 R2 R73 R89 R100 R102 R104 R112 R113 R117 R118 R123 R126 = Resistor_1206: Manufacturer: Yageo; PartNumber: RC1206JR-07100RL; ValueManufacturerPartNumber: Resistor, 1K, 1206; Power: 0.25W; Tolerance: ±5%; Package: 1206; HelpURL: https://www.digikey.com/product-detail/en/yageo/RC1206JR-07100RL/311-100ERCT-ND/732153; Temperature: -55...+125°C; TypeResistor: Resistor
R3 = Resistor_1206: Manufacturer: Yageo; PartNumber: RC1206JR-07100RL; ValueManufacturerPartNumber: Resistor, 270R, 1206; Power: 0.25W; Tolerance: ±5%; Package: 1206; HelpURL: https://www.digikey.com/product-detail/en/yageo/RC1206JR-07100RL/311-100ERCT-ND/732153; Temperature: -55...+125°C; TypeResistor: Resistor
R4 R5 R9 R43 = Resistor_1206: Manufacturer: Yageo; PartNumber: RC1206JR-07100RL; ValueManufacturerPartNumber: Resistor, 100R, 1206; Power: 0.25W; Tolerance: ±5%; Package: 1206; HelpURL: https://www.digikey.com/product-detail/en/yageo/RC1206JR-07100RL/311-100ERCT-ND/732153; Temperature: -55...+125°C; TypeResistor: Resistor
R6 R14 R17 R26 R38 R44 R58 R61 R116 R119 R129 = Resistor_1206: Manufacturer: Yageo; PartNumber: RC1206JR-07100RL; ValueManufacturerPartNumber: Resistor, 20K, 1206; Power: 0.25W; Tolerance: ±5%; Package: 1206; HelpURL: https://www.digikey.com/product-detail/en/yageo/RC1206JR-07100RL/311-100ERCT-ND/732153; Temperature: -55...+125°C; TypeResistor: Resistor
R7 R15 R16 R18 R20-R24 R33 R45-R48 R50 R51 R56 R57* R60 R69 R70 R75 R77-R81 R84 R91 R92 R98 R101 R103 R106 R110 R111 R115 R130 = Resistor_1206: Manufacturer: Yageo; PartNumber: RC1206JR-07100RL; ValueManufacturerPartNumber: Resistor, 10K, 1206; Power: 0.25W; Tolerance: ±5%; Package: 1206; HelpURL: https://www.digikey.com/product-detail/en/yageo/RC1206JR-07100RL/311-100ERCT-ND/732153; Temperature: -55...+125°C; TypeResistor: Resistor
R8 = Resistor_1206: Manufacturer: Yageo; PartNumber: RC1206JR-07100RL; ValueManufacturerPartNumber: Resistor, 680R, 1206; Power: 0.25W; Package: 1206; HelpURL: https://www.digikey.com/product-detail/en/yageo/RC1206JR-07100RL/311-100ERCT-ND/732153; Temperature: -55...+125°C; TypeResistor: Resistor
R10-R13 = Resistor_1206: Manufacturer: Yageo; PartNumber: RC1206JR-07100RL; ValueManufacturerPartNumber: Resistor, 26.7R, 1206; Power: 0.25W; Tolerance: ±5%; Package: 1206; HelpURL: https://www.digikey.com/product-detail/en/yageo/RC1206JR-07100RL/311-100ERCT-ND/732153; Temperature: -55...+125°C; TypeResistor: Resistor
R19 R25 R41 R49 R55 R63-R65 R105 = Resistor_1206: Manufacturer: Yageo; PartNumber: RC1206JR-07100RL; ValueManufacturerPartNumber: Resistor, 100K, 1206; Power: 0.25W; Tolerance: ±5%; Package: 1206; HelpURL: https://www.digikey.com/product-detail/en/yageo/RC1206JR-07100RL/311-100ERCT-ND/732153; Temperature: -55...+125°C; TypeResistor: Resistor
R27 R28 = Resistor_1206: Manufacturer: Yageo; PartNumber: RC1206JR-07100RL; ValueManufacturerPartNumber: Resistor, 10M, CFR-50; Power: 0.25W; Package: CFR-50; HelpURL: https://www.digikey.com/product-detail/en/yageo/RC1206JR-07100RL/311-100ERCT-ND/732153; Temperature: -55...+125°C; TypeResistor: Resistor
R29 R30 = Resistor_1206: Manufacturer: Yageo; PartNumber: RC1206JR-07100RL; ValueManufacturerPartNumber: Resistor, 499K, 1206; Power: 0.25W; Package: 1206; HelpURL: https://www.digikey.com/product-detail/en/yageo/RC1206JR-07100RL/311-100ERCT-ND/732153; Temperature: -55...+125°C; TypeResistor: Resistor
R31 R32 R90 R95 R97 R99 = Resistor_1206: Manufacturer: Yageo; PartNumber: RC1206JR-07100RL; ValueManufacturerPartNumber: Resistor, 47R, 1206; Power: 0.25W; Tolerance: ±5%; Package: 1206; HelpURL: https://www.digikey.com/product-detail/en/yageo/RC1206JR-07100RL/311-100ERCT-ND/732153; Temperature: -55...+125°C; TypeResistor: Resistor
R34 = Resistor_1206: Manufacturer: Yageo; PartNumber: RC1206JR-07100RL; ValueManufacturerPartNumber: Resistor, 1M, 1206; Power: 0.25W; Tolerance: ±5%; Package: 1206; HelpURL: https://www.digikey.com/product-detail/en/yageo/RC1206JR-07100RL/311-100ERCT-ND/732153; Temperature: -55...+125°C; TypeResistor: Resistor
R35 R36 R85-R88 R93 R94 R96 R108 R109 R114 R121 R124 R125 R127 R128 = Resistor_1206: Manufacturer: Yageo; PartNumber: RC1206JR-07100RL; ValueManufacturerPartNumber: Resistor, 2K, 1206; Power: 0.25W; Tolerance: ±5%; Package: 1206; HelpURL: https://www.digikey.com/product-detail/en/yageo/RC1206JR-07100RL/311-100ERCT-ND/732153; Temperature: -55...+125°C; TypeResistor: Resistor
R37 = Resistor_1206: Manufacturer: Yageo; PartNumber: RC1206JR-07100RL; ValueManufacturerPartNumber: Resistor, 4.99K, 1206; Power: 0.25W; Tolerance: ±5%; Package: 1206; HelpURL: https://www.digikey.com/product-detail/en/yageo/RC1206JR-07100RL/311-100ERCT-ND/732153; Temperature: -55...+125°C; TypeResistor: Resistor
R39 = Resistor_1206: Manufacturer: Yageo; PartNumber: RC1206JR-07100RL; ValueManufacturerPartNumber: Resistor, 49.9K, 1206; Power: 0.25W; Tolerance: ±5%; Package: 1206; HelpURL: https://www.digikey.com/product-detail/en/yageo/RC1206JR-07100RL/311-100ERCT-ND/732153; Temperature: -55...+125°C; TypeResistor: Resistor
R40 R62 = Resistor_1206: Manufacturer: Yageo; PartNumber: RC1206JR-07100RL; ValueManufacturerPartNumber: Resistor, 33.2K, 1206; Power: 0.25W; Tolerance: ±5%; Package: 1206; HelpURL: https://www.digikey.com/product-detail/en/yageo/RC1206JR-07100RL/311-100ERCT-ND/732153; Temperature: -55...+125°C; TypeResistor: Resistor
R42 = Resistor_1206: Manufacturer: Yageo; PartNumber: RC1206JR-07100RL; ValueManufacturerPartNumber: Resistor, 180K, 1206; Power: 0.25W; Tolerance: ±5%; Package: 1206; HelpURL: https://www.digikey.com/product-detail/en/yageo/RC1206JR-07100RL/311-100ERCT-ND/732153; Temperature: -55...+125°C; TypeResistor: Resistor
R52 = Resistor_1206: Manufacturer: Yageo; PartNumber: RC1206JR-07100RL; ValueManufacturerPartNumber: Resistor, 1.5K, 1206; Power: 0.25W; Tolerance: ±5%; Package: 1206; HelpURL: https://www.digikey.com/product-detail/en/yageo/RC1206JR-07100RL/311-100ERCT-ND/732153; Temperature: -55...+125°C; TypeResistor: Resistor
R53 = Resistor_1206: Manufacturer: Yageo; PartNumber: RC1206JR-07100RL; ValueManufacturerPartNumber: Resistor, 330R, 1206; Power: 0.25W; Tolerance: ±5%; Package: 1206; HelpURL: https://www.digikey.com/product-detail/en/yageo/RC1206JR-07100RL/311-100ERCT-ND/732153; Temperature: -55...+125°C; TypeResistor: Resistor
R54 = Resistor_1206: Manufacturer: Yageo; PartNumber: RC1206JR-07100RL; ValueManufacturerPartNumber: Resistor, 1.1K, 1206; Power: 0.25W; Tolerance: ±5%; Package: 1206; HelpURL: https://www.digikey.com/product-detail/en/yageo/RC1206JR-07100RL/311-100ERCT-ND/732153; Temperature: -55...+125°C; TypeResistor: Resistor
R59 R67 = Resistor_1206: Manufacturer: Yageo; PartNumber: RC1206JR-07100RL; ValueManufacturerPartNumber: Resistor, 1K, 1206; Power: 0.25W; Tolerance: ±1%; Package: 1206; HelpURL: https://www.digikey.com/product-detail/en/yageo/RC1206JR-07100RL/311-100ERCT-ND/732153; Temperature: -55...+125°C; TypeResistor: Resistor
R68 R120 = Resistor_1206: Manufacturer: Yageo; PartNumber: RC1206JR-07100RL; ValueManufacturerPartNumber: Resistor, 18.2K, 1206; Power: 0.25W; Tolerance: ±5%; Package: 1206; HelpURL: https://www.digikey.com/product-detail/en/yageo/RC1206JR-07100RL/311-100ERCT-ND/732153; Temperature: -55...+125°C; TypeResistor: Resistor
R71 R72 = Resistor_1206: Manufacturer: Yageo; PartNumber: RC1206JR-07100RL; ValueManufacturerPartNumber: Resistor, 51.1K, 1206; Power: 0.25W; Tolerance: ±5%; Package: 1206; HelpURL: https://www.digikey.com/product-detail/en/yageo/RC1206JR-07100RL/311-100ERCT-ND/732153; Temperature: -55...+125°C; TypeResistor: Resistor
R76 = Resistor_1206: Manufacturer: Yageo; PartNumber: RC1206JR-07100RL; ValueManufacturerPartNumber: Resistor, 10R, 1206; Power: 0.25W; Tolerance: ±5%; Package: 1206; HelpURL: https://www.digikey.com/product-detail/en/yageo/RC1206JR-07100RL/311-100ERCT-ND/732153; Temperature: -55...+125°C; TypeResistor: Resistor
R107 R122 R131 = Resistor_1206: Manufacturer: Yageo; PartNumber: RC1206JR-07100RL; ValueManufacturerPartNumber: Resistor, 499K, 1206; Power: 0.25W; Tolerance: ±5%; Package: 1206; HelpURL: https://www.digikey.com/product-detail/en/yageo/RC1206JR-07100RL/311-100ERCT-ND/732153; Temperature: -55...+125°C; TypeResistor: Resistor
R132 R133 = Resistor_1206: Manufacturer: Yageo; PartNumber: RC1206JR-07100RL; ValueManufacturerPartNumber: Resistor, 5.11R, 2512; Power: 0.25W; Tolerance: ±5%; Package: 2512; HelpURL: https://www.digikey.com/product-detail/en/yageo/RC1206JR-07100RL/311-100ERCT-ND/732153; Temperature: -55...+125°C; TypeResistor: Resistor
R134 = Resistor_1206: Manufacturer: Yageo; PartNumber: RC1206JR-07100RL; ValueManufacturerPartNumber: Resistor, 10K, CPF-3; Power: 3W; Tolerance: ±5%; Package: CPF-3; HelpURL: https://www.digikey.com/product-detail/en/yageo/RC1206JR-07100RL/311-100ERCT-ND/732153; Temperature: -55...+125°C; TypeResistor: Resistor
RC1 = SCM-24: PartNumber: DS1011-24SBSiB; ValueManufacturerPartNumber: DS1011-24SBSiB, 24 Pin; Package: 24 Pin
RC2 = PLS-2: Manufacturer: MOLEX; ValueManufacturerPartNumber: MOLEX, 0026013114, 2pin; PartNumber: 0026013114; TypeConnector: Connector; VoltageMax: 500VAC; Pitch: 2.54mm; CurrentMax: 3A; Multichannel: 2pin; HelpURL: https://www.chipdip.ru/product/pls-2
RC3 = PLS-12: Manufacturer: MOLEX; ValueManufacturerPartNumber: MOLEX, 0026013119, 12pin; PartNumber: 0026013119; TypeConnector: Connector; VoltageMax: 500VAC; Pitch: 2.54mm; CurrentMax: 3A; Multichannel: 12pin; HelpURL: https://www.chipdip.ru/product/pls-12
RC4 = PLS-8: Manufacturer: MOLEX; ValueManufacturerPartNumber: MOLEX, 0026013144, 8pin; PartNumber: 0026013144; TypeConnector: Connector; VoltageMax: 500VAC; Pitch: 2.54mm; CurrentMax: 3A; Multichannel: 8pin; HelpURL: https://www.chipdip.ru/product/pls-8-ds1021-1-8sf112
RC5 = PLS-6: Manufacturer: MOLEX; ValueManufacturerPartNumber: MOLEX, 0039301060, 6pin; PartNumber: 0039301060; TypeConnector: Connector; VoltageMax: 500VAC; Pitch: 2.54mm; CurrentMax: 3A; Multichannel: 6pin; HelpURL: https://www.chipdip.ru/product/pls-6
RC6 = PLS-3: Manufacturer: MOLEX; ValueManufacturerPartNumber: MOLEX, 0460140304, 3pin; PartNumber: 0460140304; TypeConnector: Connector; VoltageMax: 500VAC; Pitch: 2.54mm; CurrentMax: 3A; Multichannel: 3pin; HelpURL: https://www.chipdip.ru/product/pls-3
RC7 = PLS-2: Manufacturer: Connfly; ValueManufacturerPartNumber: PLS-2, 2pin; TypeConnector: Connector; VoltageMax: 500VAC; Pitch: 2.54mm; CurrentMax: 3A; Multichannel: 2pin; HelpURL: https://www.chipdip.ru/product/pls-2; PartNumber: PLS-2
SW1 = NDP-02: ValueManufacturerPartNumber: NDP-02, DPL-02; Package: DPL-02; PartNumber: NDP-02
T1 = T1: PartNumber: T1; ValueManufacturerPartNumber: T1
TP1 = Test_Point
U1 = CD4093: ValueManufacturerPartNumber: CD4093, SOIC-14; Package: SOIC-14; PartNumber: CD4093
U2 = LM339: PartNumber: LM239; ValueManufacturerPartNumber: LM239, SOIC-14; Package: SOIC-14
U3 = MC14013: ValueManufacturerPartNumber: MC14013, SOIC-14; Package: SOIC-14; PartNumber: MC14013
U4 = MC14023: ValueManufacturerPartNumber: MC14023, SOIC-14; Package: SOIC-14; PartNumber: MC14023
U5 = LF253: ValueManufacturerPartNumber: LF253, SOIC-8; Package: SOIC-8; PartNumber: LF253
U7 = LF347: PartNumber: LF247; ValueManufacturerPartNumber: LF247, SOIC-14; Package: SOIC-14
U8 = MC33202: ValueManufacturerPartNumber: MC33202, SOIC-8; Package: SOIC-8; PartNumber: MC33202
U9 = MC34064: PartNumber: MC33064; ValueManufacturerPartNumber: MC33064, SOIC-8; Package: SOIC-8
U10 = AD5641: ValueManufacturerPartNumber: AD5641, SC70-6; Package: SC70-6; PartNumber: AD5641
U11 = LM4040: PartNumber: LM4040A50IDZ; ValueManufacturerPartNumber: LM4040A50IDZ, SOT23-3; Package: SOT23-3
U12 = ATMega16-AU: ValueManufacturerPartNumber: ATMega16-AU, TQFP-44; Package: TQFP-44; PartNumber: ATMega16-AU
U13 = LM2940: PartNumber: LM2940-15; ValueManufacturerPartNumber: LM2940-15, SOT223; Package: SOT223
U14 = MC7805: ValueManufacturerPartNumber: MC7805, D2PAK; Package: D2PAK; PartNumber: MC7805
U15 = LM393: ValueManufacturerPartNumber: LM393, SOIC-8; Package: SOIC-8; PartNumber: LM393
U16 = IXDN602SIA: ValueManufacturerPartNumber: IXDN602SIA, SOIC-8; Package: SOIC-8; PartNumber: IXDN602SIA
U17 = L7986: ValueManufacturerPartNumber: L7986, HSOP-8; Package: HSOP-8; PartNumber: L7986
UART = PLS-4: Manufacturer: Connfly; ValueManufacturerPartNumber: PLS-4, 4pin; TypeConnector: Connector; VoltageMax: 500VAC; Pitch: 2.54mm; CurrentMax: 3A; Multichannel: 4pin; HelpURL: https://www.chipdip.ru/product/pls-4; PartNumber: PLS-4
VO1 = SFH610: PartNumber: SFH610*; ValueManufacturerPartNumber: SFH610*, SMD (option 7); Package: SMD (option 7)
Y1 = HC49SM: PartNumber: HC49SM-16.000MHZ-20PF; ValueManufacturerPartNumber: HC49SM-16.000MHZ-20PF, HC49SM; Package: HC49SM